# Altium project precursor_pvt2.PrjPcb (part 2 of 3)

## Sheet 03_power.SchDoc
size A3
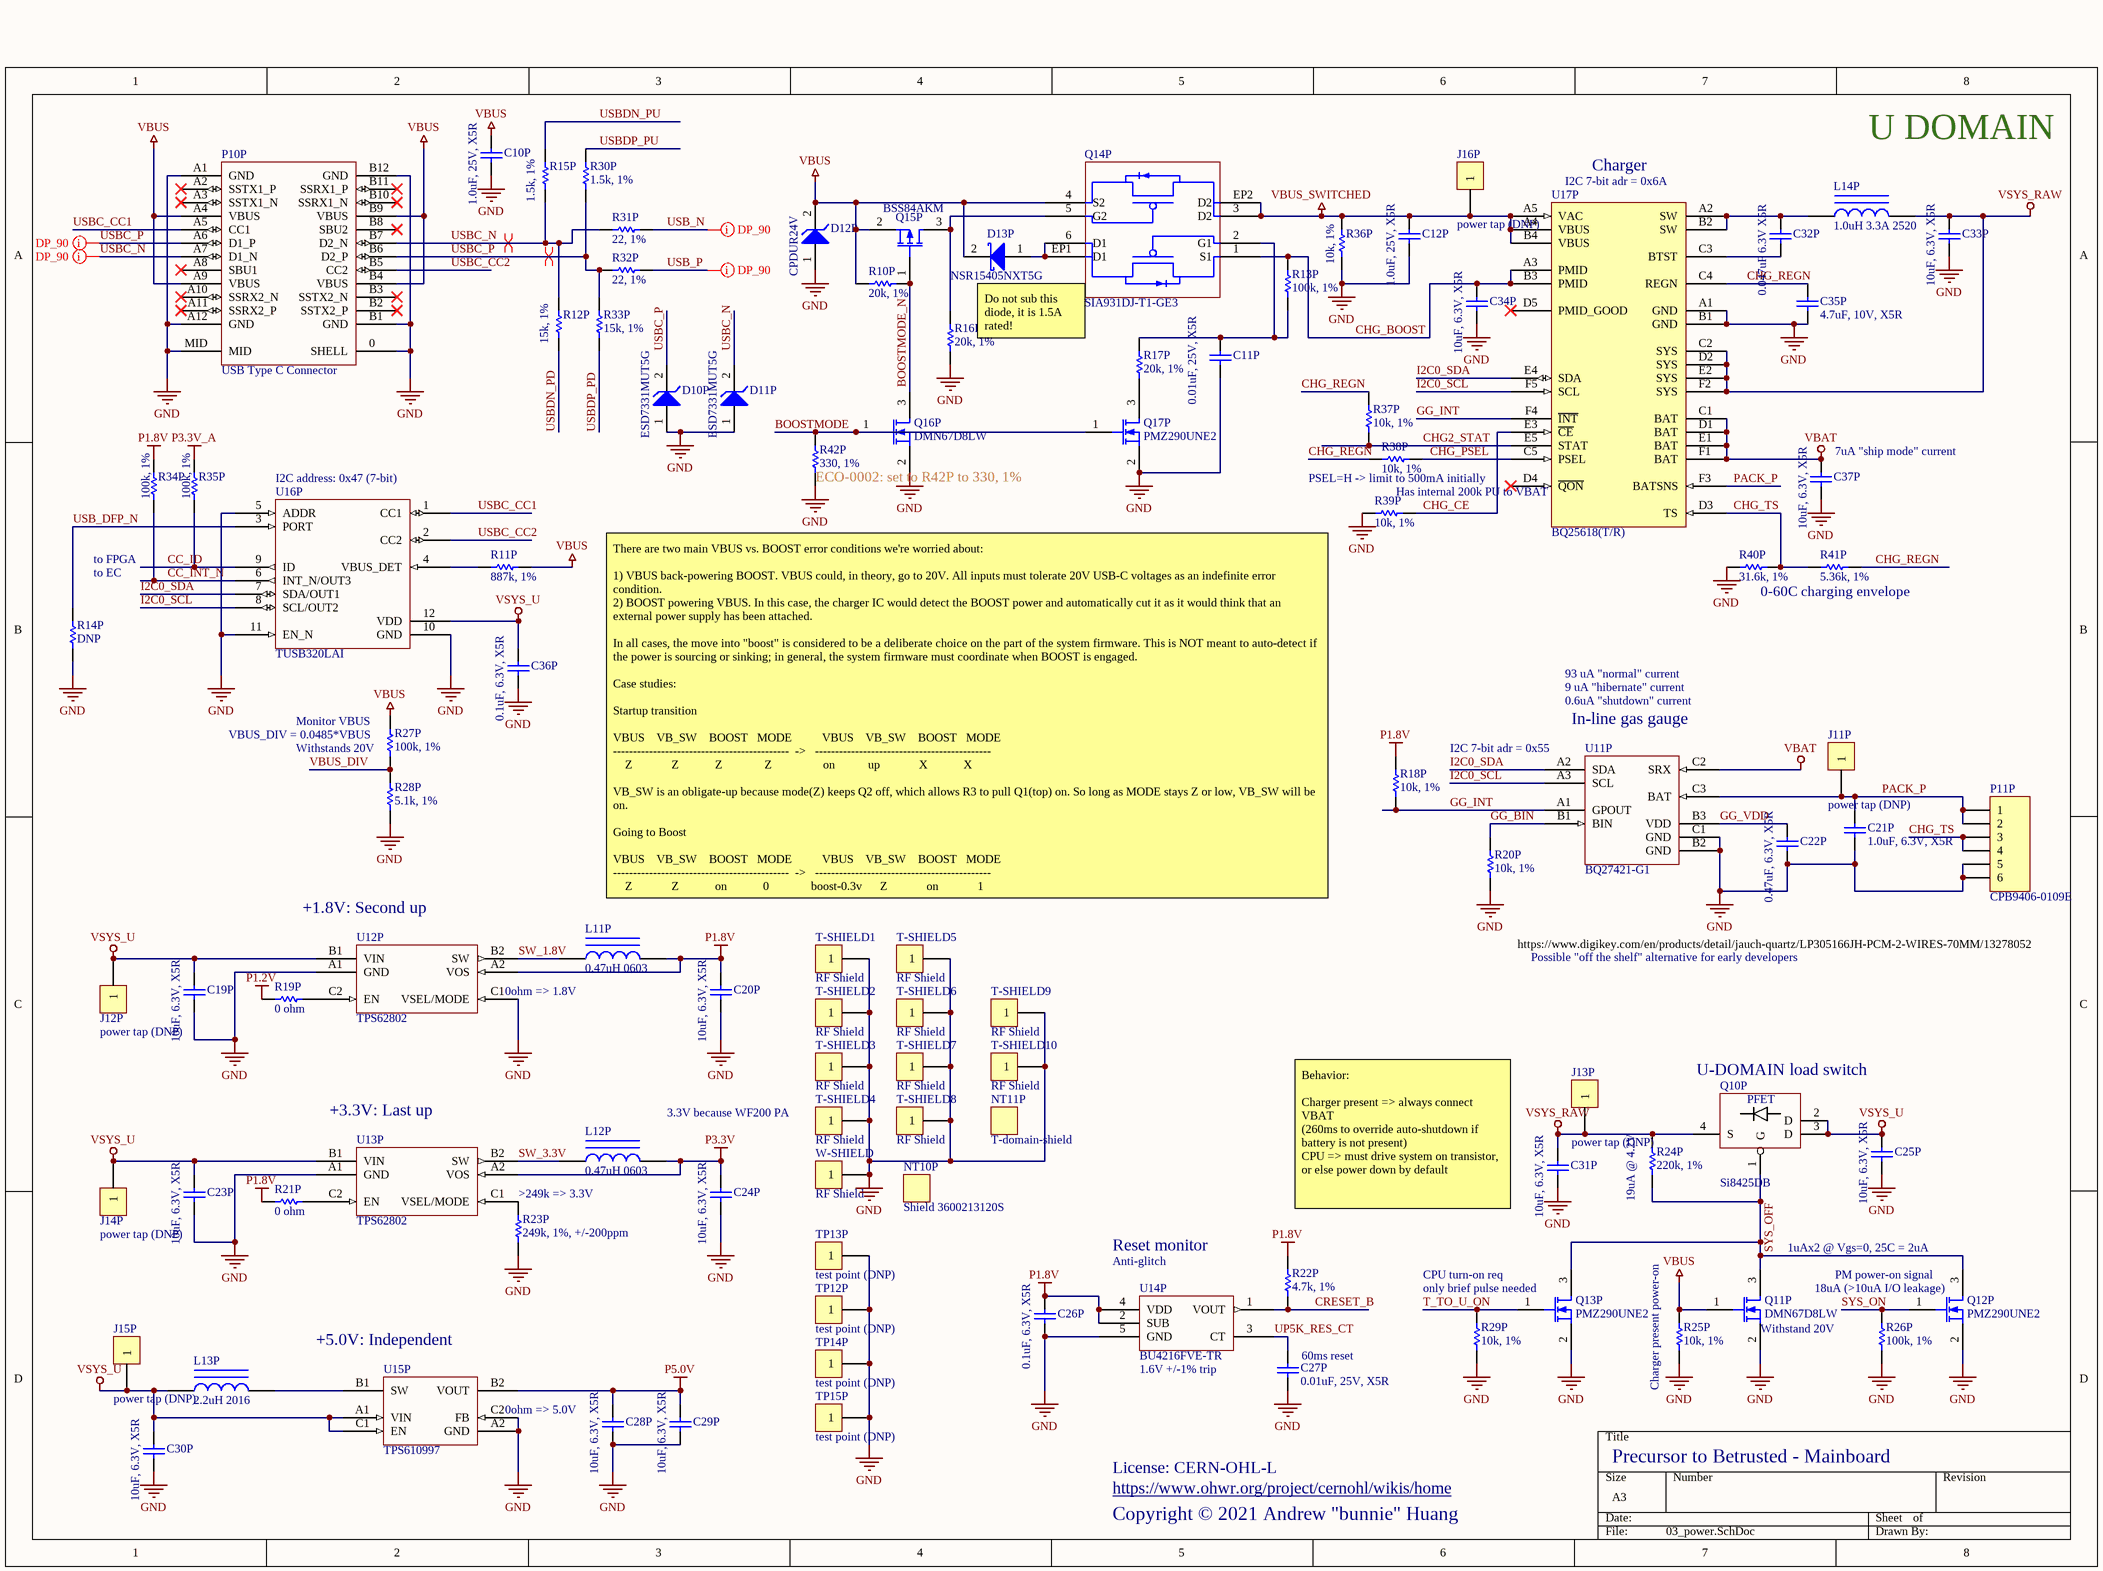
[diagram p4: 03_power.SchDoc]

### Parts
C10P  1.0uF, 25V, X5R  [B_CAP0603]
C11P  0.01uF, 25V, X5R  [B_RES0201]
C12P  1.0uF, 25V, X5R  [B_CAP0603]
C19P  10uF, 6.3V, X5R  [B_CAP0603]
C20P  10uF, 6.3V, X5R  [B_CAP0603]
C21P  1.0uF, 6.3V, X5R  [B_CAP0201]
C22P  0.47uF, 6.3V, X5R  [B_CAP0201]
C23P  10uF, 6.3V, X5R  [B_CAP0603]
C24P  10uF, 6.3V, X5R  [B_CAP0603]
C25P  10uF, 6.3V, X5R  [B_CAP0603]
C26P  0.1uF, 6.3V, X5R  [B_CAP0201]
C27P  0.01uF, 25V, X5R  [B_RES0201]
C28P  10uF, 6.3V, X5R  [B_CAP0603]
C29P  10uF, 6.3V, X5R  [B_CAP0603]
C30P  10uF, 6.3V, X5R  [B_CAP0603]
C31P  10uF, 6.3V, X5R  [B_CAP0603]
C32P  0.047uF 6.3V X5R  [B_CAP0201]
C33P  10uF, 6.3V, X5R  [B_CAP0603]
C34P  10uF, 6.3V, X5R  [B_CAP0603]
C35P  4.7uF, 10V, X5R  [B_CAP0603]
C36P  0.1uF, 6.3V, X5R  [B_CAP0201]
C37P  10uF, 6.3V, X5R  [B_CAP0603]
D10P  ESD7331MUT5G  [D_X3DFN2_0201]
D11P  ESD7331MUT5G  [D_X3DFN2_0201]
D12P  CPDUR24V  [SOD523]
D13P  NSR15405NXT5G  [B_DIO0502]
J11P  power tap (DNP)  [B_PWRTAP0402]
J12P  power tap (DNP)  [RESTAP-0603]
J13P  power tap (DNP)  [RESTAP-0603]
J14P  power tap (DNP)  [RESTAP-0603]
J15P  power tap (DNP)  [B_PWRTAP0402]
J16P  power tap (DNP)  [RESTAP-0603]
L11P  0.47uH 0603  [B_IND0603]
L12P  0.47uH 0603  [B_IND0603]
L13P  2.2uH 2016  [B_IND2016_TDK]
L14P  1.0uH 3.3A 2520  [B_IND2025_SAM]
NT10P  Shield 3600213120S
NT11P  T-domain-shield
P10P  USB Type C Connector  [TE_1-2295018-2]
P11P  CPB9406-0109E  [SMK_CPB9406-0109E]
Q10P  Si8425DB  [VISHAY_MICRO_FOOT_4_BUMP]
Q11P  DMN67D8LW  [SOT323-3AN]
Q12P  PMZ290UNE2  [SOT883]
Q13P  PMZ290UNE2  [SOT883]
Q14P  SIA931DJ-T1-GE3  [VISHAY_POWERPAK_SC70-6L]
Q15P  BSS84AKM  [SOT883]
Q16P  DMN67D8LW  [SOT323-3AN]
Q17P  PMZ290UNE2  [SOT883]
R10P  20k, 1%  [B_RES0201]
R11P  887k, 1%  [B_RES0201]
R12P  15k, 1%  [B_RES0201]
R13P  100k, 1%  [B_RES0201]
R14P  DNP  [B_RES0201]
R15P  1.5k, 1%  [B_RES0201]
R16P  20k, 1%  [B_RES0201]
R17P  20k, 1%  [B_RES0201]
R18P  10k, 1%  [B_RES0201]
R19P  0 ohm  [B_RES0201]
R20P  10k, 1%  [B_RES0201]
R21P  0 ohm  [B_RES0201]
R22P  4.7k, 1%  [B_RES0201]
R23P  249k, 1%, +/-200ppm  [B_RES0402]
R24P  220k, 1%  [B_RES0201]
R25P  10k, 1%  [B_RES0201]
R26P  100k, 1%  [B_RES0201]
R27P  100k, 1%  [B_RES0201]
R28P  5.1k, 1%  [B_RES0201]
R29P  10k, 1%  [B_RES0201]
R30P  1.5k, 1%  [B_RES0201]
R31P  22, 1%  [B_RES0201]
R32P  22, 1%  [B_RES0201]
R33P  15k, 1%  [B_RES0201]
R34P  100k, 1%  [B_RES0201]
R35P  100k, 1%  [B_RES0201]
R36P  10k, 1%  [B_RES0201]
R37P  10k, 1%  [B_RES0201]
R38P  10k, 1%  [B_RES0201]
R39P  10k, 1%  [B_RES0201]
R40P  31.6k, 1%  [B_RES0201]
R41P  5.36k, 1%  [B_RES0201]
R42P  330, 1%  [B_RES0201]
T-SHIELD1  RF Shield  [WURTH_36900000]
T-SHIELD2  RF Shield  [WURTH_36900000]
T-SHIELD3  RF Shield  [WURTH_36900000]
T-SHIELD4  RF Shield  [WURTH_36900000]
T-SHIELD5  RF Shield  [WURTH_36900000]
T-SHIELD6  RF Shield  [WURTH_36900000]
T-SHIELD7  RF Shield  [WURTH_36900000]
T-SHIELD8  RF Shield  [WURTH_36900000]
T-SHIELD9  RF Shield  [WURTH_36900000]
T-SHIELD10  RF Shield  [WURTH_36900000]
TP12P  test point (DNP)  [TP_2MM_SQ]
TP13P  test point (DNP)  [TP_2MM_SQ]
TP14P  test point (DNP)  [TP_2MM_SQ]
TP15P  test point (DNP)  [TP_2MM_SQ]
U11P  BQ27421-G1  [BGA9C50P3X3_162X158X62]
U12P  TPS62802  [BGA6C35P2X3_70X105X40_NSMD]
U13P  TPS62802  [BGA6C35P2X3_70X105X40_NSMD]
U14P  BU4216FVE-TR  [ROHM_VSOF5]
U15P  TPS610997  [BGA6C40P2X3_88X123X62]
U16P  TUSB320LAI  [QFN40P160X160X40-12N]
U17P  BQ25618(T/R)  [BGA30C40P5X6_196X236X62]
W-SHIELD  RF Shield  [WURTH_36X021312XS]

### Nets
GND: C10P.2 C11P.2 C12P.2 C19P.2 C20P.2 C21P.1 C22P.2 C23P.2 C24P.2 C25P.2 C26P.2 C27P.2 C28P.2 C29P.2 C30P.2 C31P.2 C33P.2 C34P.2 C35P.1 C36P.2 C37P.2 D10P.1(A) D11P.1(A) D12P.1(A) P10P.0(SHELL) P10P.A1(GND) P10P.A12(GND) P10P.B1(GND) P10P.B12(GND) P10P.MID P11P.5 P11P.6 Q11P.2(S) Q12P.2(S) Q13P.2(S) Q16P.2(S) Q17P.2(S) R14P.2 R16P.1 R20P.2 R23P.2 R25P.2 R26P.1 R28P.2 R29P.2 R36P.1 R39P.1 R40P.1 R42P.1 T-SHIELD1.1 T-SHIELD2.1 T-SHIELD3.1 T-SHIELD4.1 T-SHIELD5.1 T-SHIELD6.1 T-SHIELD7.1 T-SHIELD8.1 T-SHIELD9.1 T-SHIELD10.1 TP12P.1 TP13P.1 TP14P.1 TP15P.1 U11P.B2(GND) U11P.C1(GND) U12P.A1(GND) U12P.C1(VSEL/MODE) U13P.A1(GND) U14P.5(GND) U15P.A2(GND) U15P.C2(FB) U16P.5(ADDR) U16P.10(GND) U16P.11(EN_N) U17P.A1(GND) U17P.B1(GND) W-SHIELD.1
P1.2V: R19P.1
P1.8V: C20P.1 C26P.1 L11P.2 R18P.1 R21P.1 R22P.2 R34P.2 U12P.A2(VOS) U14P.2(SUB) U14P.4(VDD)
P3.3V: C24P.1 L12P.2 U13P.A2(VOS)
P3.3V_A: R35P.2
P5.0V: C28P.1 C29P.1 U15P.B2(VOUT)
PACK_P: C21P.2 J11P.1 P11P.1 P11P.2 U11P.C3(BAT) U17P.F3(BATSNS)
VBAT: C37P.1 U11P.C2(SRX) U17P.C1(BAT) U17P.D1(BAT) U17P.E1(BAT) U17P.F1(BAT)
VBUS: C10P.1 D12P.2(K) D13P.2(K) P10P.A4(VBUS) P10P.A9(VBUS) P10P.B4(VBUS) P10P.B9(VBUS) Q11P.1(G) Q14P.4(S2) Q15P.2(S) R10P.2 R11P.1 R25P.1 R27P.2
VBUS_SWITCHED: C12P.1 J16P.1 Q14P.3(D2) Q14P.EP2(D2) R36P.2 U17P.A4(VBUS) U17P.A5(VAC) U17P.B4(VBUS)
VSYS_RAW: C31P.1 C33P.1 J13P.1 L14P.2 Q10P.4(S) R24P.2 U17P.C2(SYS) U17P.D2(SYS) U17P.E2(SYS) U17P.F2(SYS)
VSYS_U: C19P.1 C23P.1 C25P.1 C30P.1 C36P.1 J12P.1 J14P.1 J15P.1 L13P.1 Q10P.2(D) Q10P.3(D) U12P.B1(VIN) U13P.B1(VIN) U15P.A1(VIN) U15P.C1(EN) U16P.12(VDD)
BOOSTMODE: Q16P.1(G) Q17P.1(G) R42P.2
BOOSTMODE_N: Q15P.1(G) Q16P.3(D) R10P.1
CC_ID: R35P.1 U16P.9(ID)
CC_INT_N: R34P.1 U16P.6(INT_N/OUT3)
CHG2_STAT: R37P.2 U17P.E5(STAT)
CHG_BOOST: C34P.1 Q14P.1(S1) R13P.1 U17P.A3(PMID) U17P.B3(PMID)
CHG_CE: R39P.2 U17P.E3(~{CE})
CHG_PSEL: R38P.2 U17P.C5(PSEL)
CHG_REGN: C35P.2 R37P.1 R38P.1 R41P.2 U17P.C4(REGN)
CHG_TS: P11P.3 P11P.4 R40P.2 R41P.1 U17P.D3(TS)
CRESET_B: R22P.1 U14P.1(VOUT)
GG_BIN: R20P.1 U11P.B1(BIN)
GG_INT: R18P.2 U11P.A1(GPOUT) U17P.F4(~{INT})
GG_VDD: C22P.1 U11P.B3(VDD)
I2C0_SCL: U11P.A3(SCL) U16P.8(SCL/OUT2) U17P.F5(SCL)
I2C0_SDA: U11P.A2(SDA) U16P.7(SDA/OUT1) U17P.E4(SDA)
SW_1.8V: L11P.1 U12P.B2(SW)
SW_3.3V: L12P.1 U13P.B2(SW)
SYS_OFF: Q10P.1(G) Q11P.3(D) Q12P.3(D) Q13P.3(D) R24P.1
SYS_ON: Q12P.1(G) R26P.2
T_TO_U_ON: Q13P.1(G) R29P.1
UP5K_RES_CT: C27P.1 U14P.3(CT)
USB_DFP_N: R14P.1 U16P.3(PORT)
USB_N: R31P.2
USB_P: R32P.2
USBC_CC1: P10P.A5(CC1) U16P.1(CC1)
USBC_CC2: P10P.B5(CC2) U16P.2(CC2)
USBC_N: D11P.2(K) P10P.A7(D1_N) P10P.B7(D2_N) R12P.1 R15P.1 R31P.1
USBC_P: D10P.2(K) P10P.A6(D1_P) P10P.B6(D2_P) R30P.1 R32P.1 R33P.1
USBDN_PD: R12P.2
USBDN_PU: R15P.2
USBDP_PD: R33P.2
USBDP_PU: R30P.2
VBUS_DIV: R27P.1 R28P.1
NetC11P_1: C11P.1 Q14P.2(G1) R13P.2 R17P.2
NetC32P_1: C32P.1 L14P.1 U17P.A2(SW) U17P.B2(SW)
NetC32P_2: C32P.2 U17P.C3(BTST)
NetD13P_1: D13P.1(A) Q14P.6(D1) Q14P.EP1(D1)
NetL13P_2: L13P.2 U15P.B1(SW)
NetQ14P_5: Q14P.5(G2) Q15P.3(D) R16P.2
NetQ17P_3: Q17P.3(D) R17P.1
NetR11P_2: R11P.2 U16P.4(VBUS_DET)
NetR19P_2: R19P.2 U12P.C2(EN)
NetR21P_2: R21P.2 U13P.C2(EN)
NetR23P_1: R23P.1 U13P.C1(VSEL/MODE)

Not connected (* = marked no-connect by the designer): P10P A2(SSTX1_P)* A3(SSTX1_N)* A8(SBU1)* A10(SSRX2_N)* A11(SSRX2_P)* B2(SSTX2_P)* B3(SSTX2_N)* B8(SBU2)* B10(SSRX1_N)* B11(SSRX1_P)*; U17P D4(~{QON})* D5(PMID_GOOD)*

### Layout directives
differential pair: USBC_N, USBC_P
net class DP_90: USB_N, USB_P, USBC_N, USBC_P

### Notes on the sheet
- (near U17P) Charger
- U DOMAIN
- (near U17P) I2C 7-bit adr = 0x6A
- Do not sub this diode, it is 1.5A rated!
- (near U16P) I2C address: 0x47 (7-bit)
- (near R42P) ECO-0002: set to R42P to 330, 1%
- (near R38P) PSEL=H -> limit to 500mA initially
- (near U17P) Has internal 200k PU to VBAT
- (near C37P) 7uA "ship mode" current
- (near R14P) to EC
- to FPGA
- 0-60C charging envelope
- 93 uA "normal" current
- 0.6uA "shutdown" current
- 9 uA "hibernate" current
- (near R27P) VBUS_DIV = 0.0485*VBUS
- (near R27P) Monitor VBUS
- (near R27P) Withstands 20V
- (near U11P) I2C 7-bit adr = 0x55
- (near U11P) In-line gas gauge
- (near U12P) +1.8V: Second up
- There are two main VBUS vs. BOOST error conditions we're worried about:
  1) VBUS back-powering BOOST. VBUS could, in theory, go to 20V. All inputs must tolerate 20V USB-C voltages as an indefinite error condition.
  2) BOOST powering VBUS. In this case, the charger IC would detect the BOOST power and automatically cut it as it would think that an external power supply has been attached.
  In all cases, the move into "boost" is considered to be a deliberate choice on the part of the system firmware. This is NOT meant to auto-detect if the power is sourcing or sinking; in general, the system firmware must coordinate when BOOST is engaged.
  Case studies:
  Startup transition
  VBUS    VB_SW    BOOST   MODE          VBUS    VB_SW    BOOST   MODE
  --------------------------------------------  ->   --------------------------------------------
  Z             Z            Z              Z                 on           up             X            X
  VB_SW is an obligate-up because mode(Z) keeps Q2 off, which allows R3 to pull Q1(top) on. So long as MODE stays Z or low, VB_SW will be on.
  Going to Boost
  VBUS    VB_SW    BOOST   MODE          VBUS    VB_SW    BOOST   MODE
  --------------------------------------------  ->   --------------------------------------------
  Z             Z            on            0              boost-0.3v      Z             on             1
  Initially, boost is ON, VBUS is disconnected (Z), mode is off. VB_SW is obligate Z because it's connected to VBUS, and BOOST is isolated from VBUS because Q1(bot) is off due to R2 bringing VGS=0 and Q4 being off, and the body diode is reverse biased. Mode going from 0->1 will bring Q2 VGS > -1.6V and thus"on" (around 6 ohm), making Q1(top) VGS  0 and thus off. VB_SW is isolated. Also mode going 0->1 brings Q4 on, which takes Q1(bot) VGS > -1.8V, turning it on, and thus causing BOOST to conduct to VBUS less D2 drop of 0.3V. BOOST regulation is 5.15V, so VBUS is around 4.85V, within spec for VBUS source.
  It is important that VB_SW does not get the BOOST voltage, as this will cause BOOST to turn off. It may be more desirable then to do this scenario:
  Going to Boost
  VBUS    VB_SW    BOOST   MODE          VBUS    VB_SW    BOOST   MODE
  --------------------------------------------  ->   --------------------------------------------
  Z             Z            Z            1              boost-0.3v      Z             on             1
  In this case, everything is hi-Z to start with, MODE is switched on; this forces Q2 on, and thus Q1(top) off. Q4 on turns Q1(bot) on. As BOOST rises, Q1(bot) definitively turns on, charging VBUS. As VBUS rises, Q1(top) should never conduct as Q2 keeps VGS0, thus VB_SW should never see the BOOST voltage (this is good). There may be some charge bootstrapping but CQ1 is << CVB_SW.
  Leaving boost
  This can be accomplished either by dropping BOOST or MODE first, then applying VBUS.
  Error condition 1: VBUS is applied (at possibly 20V), BOOST active
  In this case, D2 protects CHG_BOOST, when both in MODE is 1 or 0. D2 is necessary because of the body diode in Q1. D2 could be replaced with a transistor for better efficiency, but space limitations and cost drives the choice of using a diode not a transistor.
  D2 is rated to 30V, Q1 VDSS to 30V, Q2 VDSS is 50V. Q1, Q2 VGS is -20V, which is slightly dicey but probably OK.
  Q3 rated to 60V VDSS, -30V VGS, which is ideal. Q4 is not rated for 20V operation, but the BOOST node is incapable of going over 5.15V, and is protected by D2.
  VB_SW can handle 20V (regulator can tolerate this).
  Error condition 2: Boost powering VBUS
  The main mechanism for this to happen is if Q4/Q1(bot) combo makes a closed circuit before Q3/Q2/Q1(top) can become an open circuit, and BOOST is powered on while this is happening.
  This seems possible -- Q4->Q1 chain has a lower VGS device, and fewer devices in the signal path. Thus it may be preferable to add a small capacitance off of the Q4 drain to keep it from falling faster than Q1 gate can rise. Alternatively, software can simply enforce that MODE is active before BOOST is programmed, thus completely disallowing the error condition.
- https://www.digikey.com/en/products/detail/jauch-quartz/LP305166JH-PCM-2-WIRES-70MM/13278052
- Possible "off the shelf" alternative for early developers
- 0ohm => 1.8V
- (near U13P) +3.3V: Last up
- 3.3V because WF200 PA
- (near Q10P) U-DOMAIN load switch
- (near R23P) >249k => 3.3V
- Reset monitor
- Behavior:
  Charger present => always connect VBAT
  (260ms to override auto-shutdown if battery is not present)
  CPU => must drive system on transistor, or else power down by default
- (near R24P) 19uA @ 4.2V
- 1uAx2 @ Vgs=0, 25C = 2uA
- (near U14P) Anti-glitch
- CPU turn-on req
- (near Q13P) only brief pulse needed
- (near Q12P) 18uA (>10uA I/O leakage)
- (near Q12P) PM power-on signal
- (near U15P) +5.0V: Independent
- (near U14P) 1.6V +/-1% trip
- (near C27P) 60ms reset
- (near R25P) Charger present power-on
- (near Q11P) Withstand 20V
- 0ohm => 5.0V
- License: CERN-OHL-L
- Copyright © 2021 Andrew "bunnie" Huang
- https://www.ohwr.org/project/cernohl/wikis/home
- Precursor to Betrusted - Mainboard
- (in symbol Si8425DB) PFET

### Library data of the parts
C10P C12P = Cap Semi: as C63F on sheet 01_fpga
C11P C27P = Cap Semi: as C35F on sheet 01_fpga
C19P C20P C23P C24P C25P C28P C29P C30P C31P C33P C34P C37P = Cap Semi: as C11F on sheet 01_fpga
C21P = Cap Semi: as C22F on sheet 01_fpga
C22P = Cap Semi: as C10F on sheet 01_fpga
C26P C36P = Cap Semi: as C12F on sheet 01_fpga
C32P = Cap Semi: Capacitor (Semiconductor SIM Model); MPN: GRM033C81A473KE05D; VENDOR: Murata; MYPN: C-473-10-X6S-0201
C35P = Cap Semi: Capacitor (Semiconductor SIM Model); MPN: CL10A475KP8NNNC; VENDOR: Samsung; MYPN: C-475-10-X5R-0603
D10P D11P = D Zener: VENDOR: ON Semi; MYPN: D-ESD7331MUT5G; Published: 8-Jun-2000; LatestRevisionDate: 17-Jul-2002; LatestRevisionNote: Re-released for DXP Platform.; PackageReference: DIODE-0.7; Publisher: Altium Limited; PackageDescription: Diode, Thru-Hole; 2 Leads; 0.7 in Pin Spacing; MPN: ESD7331MUT5G
D12P = D Zener: VENDOR: Comchip Technology; MYPN: D-CPDUR24V; Published: 8-Jun-2000; LatestRevisionDate: 17-Jul-2002; LatestRevisionNote: Re-released for DXP Platform.; PackageReference: DIODE-0.7; Publisher: Altium Limited; PackageDescription: Diode, Thru-Hole; 2 Leads; 0.7 in Pin Spacing; MPN: CPDUR24V
D13P = Diode 11DQ03: Schottky Rectifier; MYPN: D-SCHOTTKY-0402-CSP; VENDOR: On Semiconductor; ComponentLink1Description: Manufacturer Link; ComponentLink1URL: http://www.irf.com/; ComponentLink2Description: Datasheet; ComponentLink2URL: http://www.irf.com/product-info/datasheets/data/11dq03.pdf; MPN: NSR15405NXT5G
J11P J12P J13P J14P J15P J16P = CON1: Connector; MYPN: J-TP-PWRTAP-0603; MPN: DNP; VENDOR: DNP
L11P L12P = Inductor Iron: as L12F on sheet 01_fpga
L13P = Inductor Iron: Magnetic-Core Inductor; MPN: VLS201610CX-2R2M-1; VENDOR: TDK; MYPN: L-VLS201610CX-2R2M-1
L14P = Inductor Iron: Magnetic-Core Inductor; MPN: CIGW252010GL1R0MNE; VENDOR: Samsung; MYPN: L-CIGW252010GL1R0MNE
NT10P = NOTE: RF Shield snap-on; MYPN: NT-3600213120S; VENDOR: Wurth; MPN: 3600213120S
NT11P = NOTE: RF Shield snap-on C7521; MPN: t-domain-shield-c7521; VENDOR: AQS; MYPN: t-domain-shield-c7521
P10P = USB_TYPE_C: MPN: 1-2295018-2; VENDOR: TE Connectivity AMP Connectors; MYPN: P-1-2295018-2
P11P = Header 6: Header, 6-Pin; VENDOR: SMK; LatestRevisionDate: 17-Jul-2002; LatestRevisionNote: Re-released for DXP Platform.; Publisher: Altium Limited; MPN: CPB9406-0109E; MYPN: CPB9406-0109E
Q10P = Si8425DB: P-channel 20V 6.2A 27mOhm @ -2.5V; MPN: SI8425DB-T1-E1; VENDOR: Vishay Siliconix; MYPN: Q-Si8425
Q11P Q16P = MOSFET-N: N-Channel MOSFET; VENDOR: Diodes Inc; MYPN: Q-DMN67D8LW; Published: 8-Jun-2000; LatestRevisionDate: 17-Jul-2002; LatestRevisionNote: Re-released for DXP Platform.; PackageVersion: 1995/1996; PackageReference: E3; Publisher: Altium Limited; MPN: DMN67D8LW
Q12P Q13P Q17P = MOSFET-N: N-Channel MOSFET; MPN: PMZ290UNE2YL; VENDOR: Nexperia; MYPN: Q-PMZ290UNE2; Published: 8-Jun-2000; LatestRevisionDate: 17-Jul-2002; LatestRevisionNote: Re-released for DXP Platform.; PackageVersion: 1995/1996; PackageReference: E3; Publisher: Altium Limited
Q14P = SIA931DJ: Dual P-channel 30V MOSFET; MYPN: Q-SIA931DJ-T1-GE3; VENDOR: Vishay Siliconix; MPN: SIA931DJ-T1-GE3
Q15P = MOSFET-P: P-Channel MOSFET; MPN: BSS84AKM,315; VENDOR: NXP; MYPN: Q-BSS84AKM; Published: 8-Jun-2000; LatestRevisionDate: 17-Jul-2002; LatestRevisionNote: Re-released for DXP Platform.; PackageVersion: 1995/1996; PackageReference: E3; Publisher: Altium Limited; PackageDescription: TO, Flat Index; 3 In-Line, Axial Leads; Body Dia. 4.6mm; Lead Dia. 0.5 mm (max)
R10P R16P R17P = Res1: Resistor; VENDOR: ANY; MYPN: R-203-1P-1_16W-0201; MPN: ANY
R11P = Res1: Resistor; VENDOR: ANY; MYPN: R-8873-1P-1_16W-0201; MPN: ANY
R12P R33P = Res1: Resistor; VENDOR: ANY; MYPN: R-153-1P-1_16W-0201; MPN: ANY
R13P R26P R27P R34P R35P = Res1: as R14F on sheet 01_fpga; MPN: ANY
R14P = Res1: Resistor; VENDOR: ANY; MYPN: DNP; MPN: ANY
R15P R30P = Res1: Resistor; VENDOR: ANY; MYPN: R-152-1P-1_16W-0201; MPN: ANY
R18P R20P R25P R29P R36P R37P R38P R39P = Res1: as R16F on sheet 01_fpga; MPN: ANY
R19P R21P = Res1: as R12F on sheet 01_fpga; MPN: ANY
R22P = Res1: as R15F on sheet 01_fpga; MPN: ANY
R23P = Res1: Resistor; MPN: RC0402FR-07249KL; VENDOR: Yageo; MYPN: R-2493-1P-1_16W-0402
R24P = Res1: as R10F on sheet 01_fpga; MPN: ANY
R28P = Res1: Resistor; VENDOR: ANY; MYPN: R-512-1P-1_16W-0201; MPN: ANY
R31P R32P = Res1: Resistor; VENDOR: ANY; MYPN: R-220-1P-1_16W-0201; MPN: ANY
R40P = Res1: Resistor; VENDOR: ANY; MYPN: R-3162-1P-1_16W-0201; MPN: ANY
R41P = Res1: Resistor; VENDOR: ANY; MYPN: R-5361-1P-1_16W-0201; MPN: ANY
R42P = Res1: Resistor; VENDOR: ANY; MYPN: R-331-1P-1_16W-0201; MPN: ANY
T-SHIELD1-T-SHIELD10 = CON1: Connector; MPN: FDX0070A1; MYPN: J-36900000; VENDOR: 深圳市元升电子有限公司
TP12P TP13P TP14P TP15P = CON1: Connector; MYPN: Built into PCB; MPN: DNP; VENDOR: DNP
U11P = BQ27421-G1: System-Side Impedance Track Fuel Gauge with integrated Sense Resistor; MPN: bq27421YZFT-G1A; VENDOR: TI; MYPN: bq27421YZF(T/R)-G1A
U12P U13P = TPS62802: as U13F on sheet 01_fpga
U14P = BU42xxFVE: Low voltage free delay time setting CMOS voltage detector IC; MYPN: U-BU4216FVE-TR; VENDOR: Rohm; MPN: BU4216FVE-TR
U15P = TPS610997: Synchronous Boost Converter with Ultra-Low Iq; MPN: TPS610997YFFR; VENDOR: TI; MYPN: TPS610997YFFT(T/R)
U16P = TUSB320LAI: USB Type-C Configuration Channel Logic and Port Control; MPN: TUSB320LAIRWBR; VENDOR: TI; MYPN: U-TUSB320LAI
U17P = BQ25618: I2C controlled 1-cell 1.5A battery charger with 20mA termination and 1A boost operation; MPN: BQ25618YFFT; VENDOR: TI; MYPN: U-BQ25618YFF(T/R)
W-SHIELD = CON1: Connector; MPN: 3610213126S; VENDOR: Wurth; MYPN: 3610213126S

## Sheet 04_io.SchDoc
size B
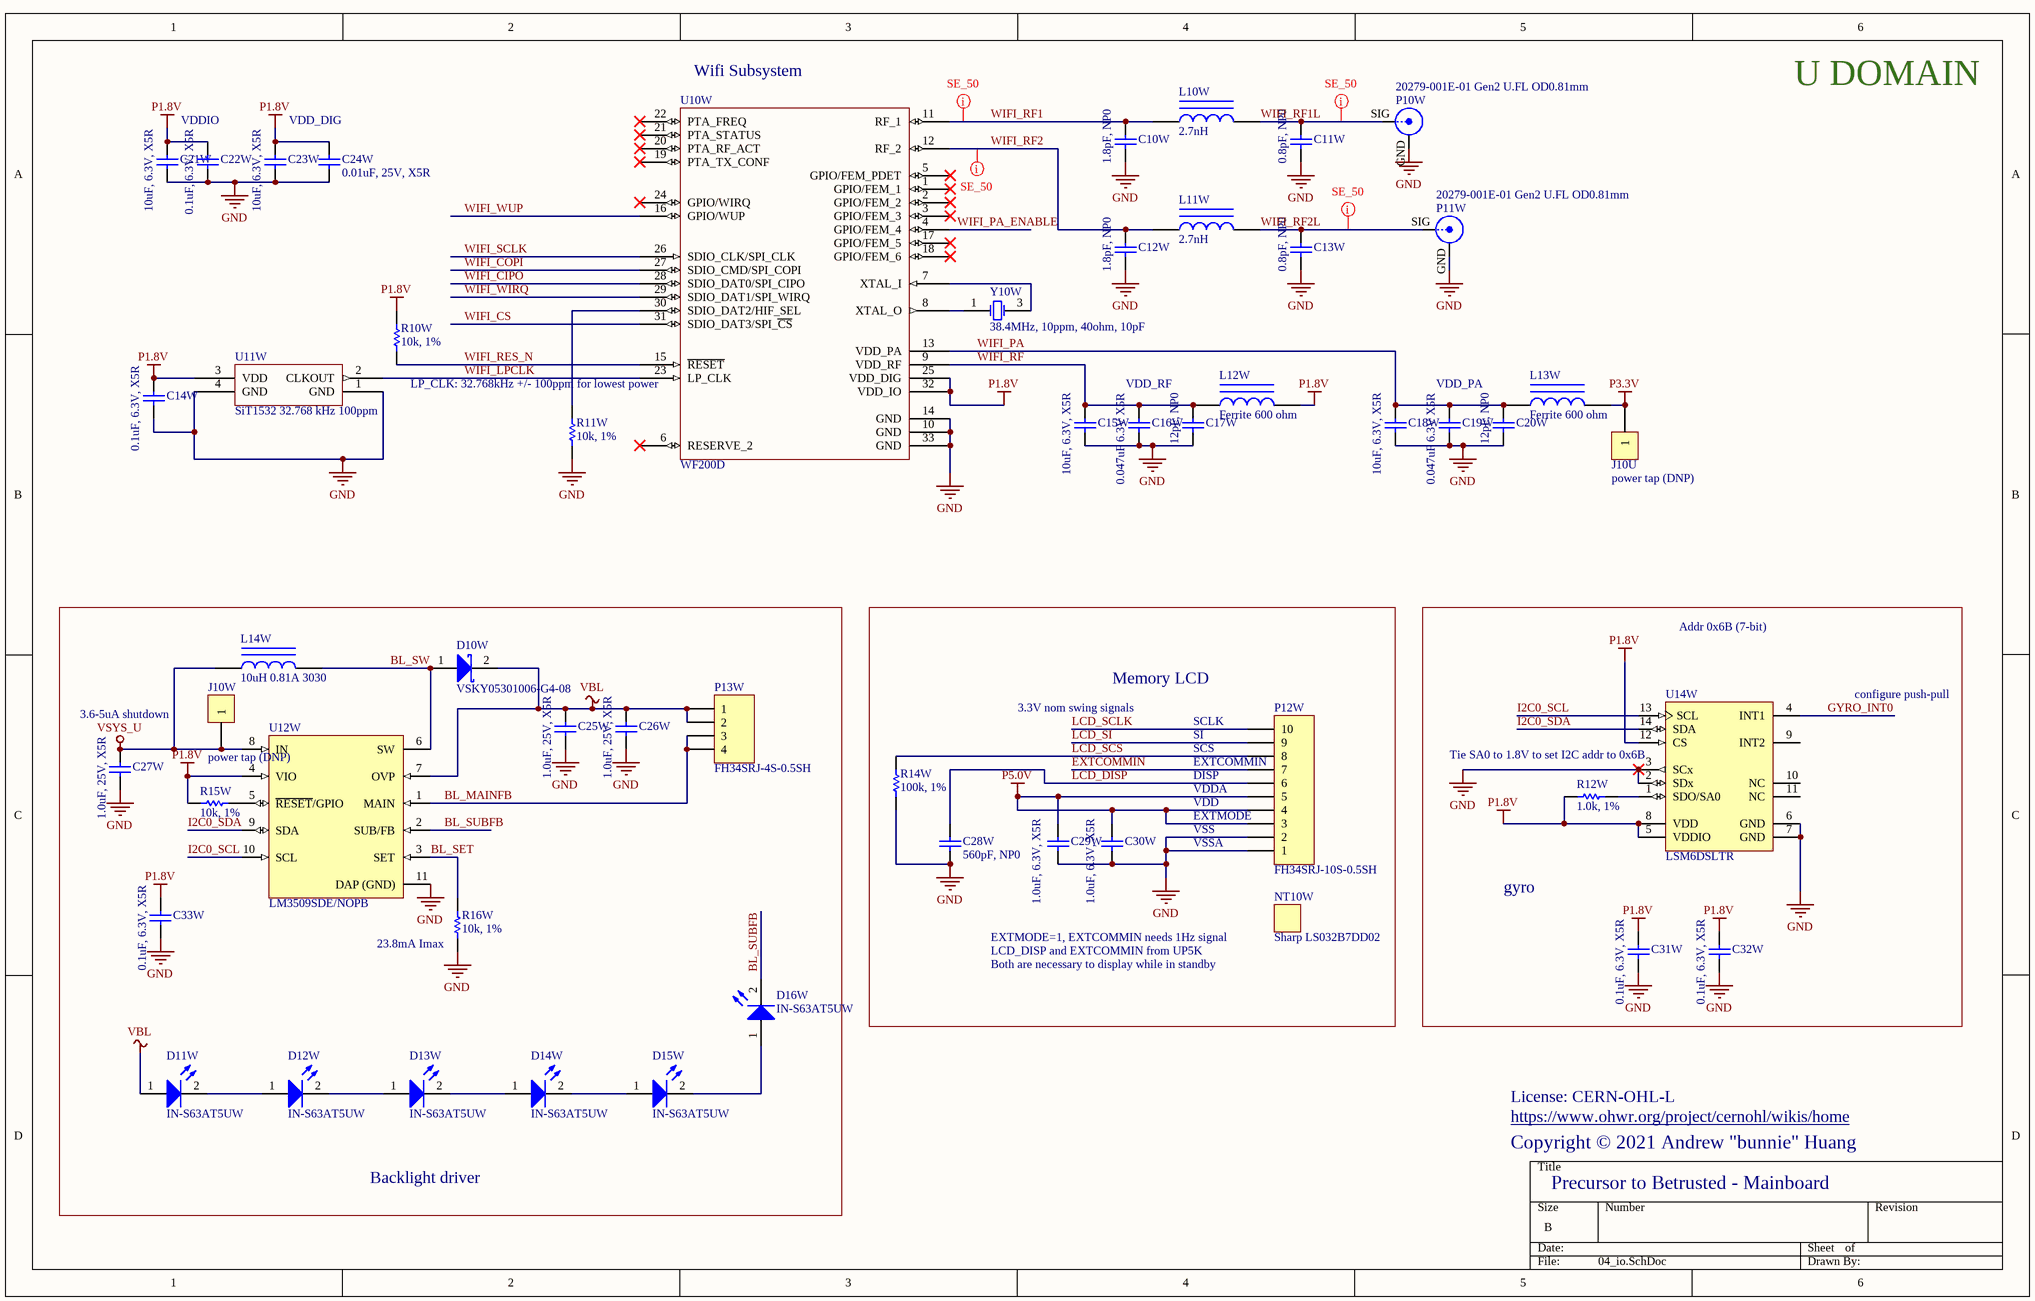
[diagram p5: 04_io.SchDoc]

### Parts
C10W  1.8pF, NP0  [B_CAP0201]
C11W  0.8pF, NP0  [B_CAP0201]
C12W  1.8pF, NP0  [B_CAP0201]
C13W  0.8pF, NP0  [B_CAP0201]
C14W  0.1uF, 6.3V, X5R  [B_CAP0201]
C15W  10uF, 6.3V, X5R  [B_CAP0603]
C16W  0.047uF 6.3V X5R  [B_CAP0201]
C17W  12pF, NP0  [B_CAP0201]
C18W  10uF, 6.3V, X5R  [B_CAP0603]
C19W  0.047uF 6.3V X5R  [B_CAP0201]
C20W  12pF, NP0  [B_CAP0201]
C21W  10uF, 6.3V, X5R  [B_CAP0603]
C22W  0.1uF, 6.3V, X5R  [B_CAP0201]
C23W  10uF, 6.3V, X5R  [B_CAP0603]
C24W  0.01uF, 25V, X5R  [B_RES0201]
C25W  1.0uF, 25V, X5R  [B_CAP0603]
C26W  1.0uF, 25V, X5R  [B_CAP0603]
C27W  1.0uF, 25V, X5R  [B_CAP0603]
C28W  560pF, NP0  [B_RES0201]
C29W  1.0uF, 6.3V, X5R  [B_CAP0201]
C30W  1.0uF, 6.3V, X5R  [B_CAP0201]
C31W  0.1uF, 6.3V, X5R  [B_CAP0201]
C32W  0.1uF, 6.3V, X5R  [B_CAP0201]
C33W  0.1uF, 6.3V, X5R  [B_CAP0201]
D10W  VSKY05301006-G4-08  [B_DIO0402]
D11W  IN-S63AT5UW  [B_DIO0603]
D12W  IN-S63AT5UW  [B_DIO0603]
D13W  IN-S63AT5UW  [B_DIO0603]
D14W  IN-S63AT5UW  [B_DIO0603]
D15W  IN-S63AT5UW  [B_DIO0603]
D16W  IN-S63AT5UW  [B_DIO0603]
J10U  power tap (DNP)  [RESTAP-0603]
J10W  power tap (DNP)  [RESTAP-0603]
L10W  2.7nH  [B_IND0402]
L11W  2.7nH  [B_IND0402]
L12W  Ferrite 600 ohm  [B_IND0603]
L13W  Ferrite 600 ohm  [B_IND0603]
L14W  10uH 0.81A 3030  [B_IND3030_MUR]
NT10W  Sharp LS032B7DD02
P10W  20279-001E-01 Gen2 U.FL OD0.81mm  [HRS_U.FL]
P11W  20279-001E-01 Gen2 U.FL OD0.81mm  [HRS_U.FL]
P12W  FH34SRJ-10S-0.5SH  [HRS_FH34SRJ-10S-0.5SH(50)]
P13W  FH34SRJ-4S-0.5SH  [HRS_FH34SRJ-4S-0.5SH(50)]
R10W  10k, 1%  [B_RES0201]
R11W  10k, 1%  [B_RES0201]
R12W  1.0k, 1%  [B_RES0201]
R14W  100k, 1%  [B_RES0201]
R15W  10k, 1%  [B_RES0201]
R16W  10k, 1%  [B_RES0201]
U10W  WF200D  [QFN40P400X400X90_HS-33N]
U11W  SiT1532 32.768 kHz 100ppm  [SiTIME_CSP]
U12W  LM3509SDE/NOPB  [DSC0010A_V]
U14W  LSM6DSLTR  [LGA-14_2500X3000X860_N]
Y10W  38.4MHz, 10ppm, 40ohm, 10pF  [XOSC_3.2_2.5]

### Blocks framed on the sheet
Backlight driver: C25W C26W C27W C33W D10W D11W D12W D13W D14W D15W D16W J10W L14W P13W R15W R16W U12W
Memory LCD: C28W C29W C30W NT10W P12W R14W
gyro: C31W C32W R12W U14W

### Nets
GND: C10W.2 C11W.2 C12W.2 C13W.2 C14W.2 C15W.2 C16W.2 C17W.2 C18W.2 C19W.2 C20W.2 C21W.2 C22W.2 C23W.2 C24W.2 C25W.2 C26W.2 C27W.2 C28W.2 C29W.1 C30W.1 C31W.2 C32W.2 C33W.2 P10W.GND(Y) P11W.GND(Y) P12W.1 P12W.2 R11W.2 R14W.1 R16W.2 U10W.10(GND) U10W.14(GND) U10W.33(GND) U11W.1(GND) U11W.4(GND) U12W.11(DAP_(GND)) U14W.2(SDx) U14W.3(SCx) U14W.6(GND) U14W.7(GND)
P1.8V: C14W.1 C21W.1 C22W.1 C23W.1 C24W.1 C31W.1 C32W.1 C33W.1 L12W.2 R10W.1 R12W.2 R15W.1 U10W.25(VDD_DIG) U10W.32(VDD_IO) U11W.3(VDD) U12W.4(VIO) U14W.5(VDDIO) U14W.8(VDD) U14W.12(CS)
P3.3V: J10U.1 L13W.2
P5.0V: C29W.2 C30W.2 P12W.3 P12W.4 P12W.5
VBL: C25W.1 C26W.1 D10W.2(K) D11W.1(A) P13W.1 P13W.2 U12W.7(OVP)
VSYS_U: C27W.1 J10W.1 L14W.1 U12W.8(IN)
BL_MAINFB: P13W.3 P13W.4 U12W.1(MAIN)
BL_SET: R16W.1 U12W.3(SET)
BL_SUBFB: D16W.2(K) U12W.2(SUB/FB)
BL_SW: D10W.1(A) L14W.2 U12W.6(SW)
EXTCOMMIN: P12W.7
GYRO_INT0: U14W.4(INT1)
I2C0_SCL: U12W.10(SCL) U14W.13(SCL)
I2C0_SDA: U12W.9(SDA) U14W.14(SDA)
LCD_DISP: C28W.1 P12W.6
LCD_SCLK: P12W.10
LCD_SCS: P12W.8 R14W.2
LCD_SI: P12W.9
WIFI_CIPO: U10W.28(SDIO_DAT0/SPI_CIPO)
WIFI_COPI: U10W.27(SDIO_CMD/SPI_COPI)
WIFI_CS: U10W.31(SDIO_DAT3/SPI_~{CS})
WIFI_LPCLK: U10W.23(LP_CLK) U11W.2(CLKOUT)
WIFI_PA: C18W.1 C19W.1 C20W.1 L13W.1 U10W.13(VDD_PA)
WIFI_PA_ENABLE: U10W.4(GPIO/FEM_4)
WIFI_RES_N: R10W.2 U10W.15(~{RESET})
WIFI_RF: C15W.1 C16W.1 C17W.1 L12W.1 U10W.9(VDD_RF)
WIFI_RF1: C10W.1 L10W.1 U10W.11(RF_1)
WIFI_RF1L: C11W.1 L10W.2 P10W.SIG(X)
WIFI_RF2: C12W.1 L11W.1 U10W.12(RF_2)
WIFI_RF2L: C13W.1 L11W.2 P11W.SIG(X)
WIFI_SCLK: U10W.26(SDIO_CLK/SPI_CLK)
WIFI_WIRQ: U10W.29(SDIO_DAT1/SPI_WIRQ)
WIFI_WUP: U10W.16(GPIO/WUP)
NetD11W_2: D11W.2(K) D12W.1(A)
NetD12W_2: D12W.2(K) D13W.1(A)
NetD13W_2: D13W.2(K) D14W.1(A)
NetD14W_2: D14W.2(K) D15W.1(A)
NetD15W_2: D15W.2(K) D16W.1(A)
NetR11W_1: R11W.1 U10W.30(SDIO_DAT2/HIF_SEL)
NetR12W_1: R12W.1 U14W.1(SDO/SA0)
NetR15W_2: R15W.2 U12W.5(~{RESET}/GPIO)
NetU10W_7: U10W.7(XTAL_I) Y10W.3(OSC2)
NetU10W_8: U10W.8(XTAL_O) Y10W.1(OSC1)

Not connected (* = marked no-connect by the designer): U10W 1(GPIO/FEM_1)* 2(GPIO/FEM_2)* 3(GPIO/FEM_3)* 5(GPIO/FEM_PDET)* 6(RESERVE_2)* 17(GPIO/FEM_5)* 18(GPIO/FEM_6)* 19(PTA_TX_CONF)* 20(PTA_RF_ACT)* 21(PTA_STATUS)* 22(PTA_FREQ)* 24(GPIO/WIRQ)*; U14W 9(INT2) 10(NC) 11(NC)

### Layout directives
net class SE_50: WIFI_RF1, WIFI_RF1L, WIFI_RF2, WIFI_RF2L

### Notes on the sheet
- (near U10W) Wifi Subsystem
- U DOMAIN
- VDDIO
- VDD_DIG
- (near U10W) LP_CLK: 32.768kHz +/- 100ppm for lowest power
- VDD_RF
- VDD_PA
- Addr 0x6B (7-bit)
- 3.3V nom swing signals
- configure push-pull
- 3.6-5uA shutdown
- SCLK
- SI
- SCS
- (near P12W) EXTCOMMIN
- DISP
- (near U14W) Tie SA0 to 1.8V to set I2C addr to 0x6B
- VDDA
- VDD
- (near P12W) EXTMODE
- VSS
- VSSA
- (near R16W) 23.8mA Imax
- EXTMODE=1, EXTCOMMIN needs 1Hz signal
- LCD_DISP and EXTCOMMIN from UP5K
- (near NT10W) Both are necessary to display while in standby
- License: CERN-OHL-L
- Copyright © 2021 Andrew "bunnie" Huang
- https://www.ohwr.org/project/cernohl/wikis/home
- Precursor to Betrusted - Mainboard

### Library data of the parts
C10W C12W = Cap Semi: Capacitor (Semiconductor SIM Model); MPN: GRM0335C1H1R8BA01D; VENDOR: Murata; MYPN: C-1R8-50-NP0-0201
C11W C13W = Cap Semi: Capacitor (Semiconductor SIM Model); MPN: GRM0335C1ER80BA01D; VENDOR: Murata; MYPN: C-0R8-25-NP0-0201
C14W C22W C31W C32W C33W = Cap Semi: Capacitor (Semiconductor SIM Model); MPN: CL03A104KQ3NNNC; VENDOR: Samsung; MYPN: C-104-6p3-X5R-0201
C15W C18W C21W C23W = Cap Semi: Capacitor (Semiconductor SIM Model); MPN: CL10A106MQ8NNNC; VENDOR: Samsung; MYPN: C-106-6.3-X5R-0603
C16W C19W = Cap Semi: Capacitor (Semiconductor SIM Model); MPN: GRM033C81A473KE05D; VENDOR: Murata; MYPN: C-473-10-X6S-0201
C17W C20W = Cap Semi: Capacitor (Semiconductor SIM Model); MPN: GRM0335C1E120JA01D; VENDOR: Murata; MYPN: C-120-25-NP0-0201
C24W = Cap Semi: Capacitor (Semiconductor SIM Model); MPN: GRM033R61E103KA12D; VENDOR: Murata; MYPN: C-103-25-X5R-0201
C25W C26W C27W = Cap Semi: Capacitor (Semiconductor SIM Model); MPN: CL10A105KA8NNNC; VENDOR: Samsung; MYPN: C-105-25-X5R-0603
C28W = Cap Semi: Capacitor (Semiconductor SIM Model); MPN: GRM0335C1E561JA01D; VENDOR: Murata; MYPN: C-561-25-NP0-0201
C29W C30W = Cap Semi: Capacitor (Semiconductor SIM Model); MPN: GRM033R60J105MEA2D; VENDOR: Murata; MYPN: C-105-6p3-X5R-0201
D10W = Diode 11DQ03: Schottky Rectifier; MYPN: D-SCHOTTKY-0402-CSP; VENDOR: Vishay; ComponentLink1Description: Manufacturer Link; ComponentLink1URL: http://www.irf.com/; ComponentLink2Description: Datasheet; ComponentLink2URL: http://www.irf.com/product-info/datasheets/data/11dq03.pdf; MPN: VSKY05301006-G4-08
D11W D12W D13W D14W D15W D16W = LED2: White LED, 0603, 900mcd, 0.4mm; MYPN: D-LED-WHT-0603-0.4mm; VENDOR: Inolux; Published: 8-Jun-2000; LatestRevisionDate: 17-Jul-2002; LatestRevisionNote: Re-released for DXP Platform.; PackageVersion: Feb-2002; PackageReference: 3.2X1.6X1.1; Publisher: Altium Limited; MPN: IN-S63AT5UW
J10U J10W = CON1: Connector; MYPN: J-TP-PWRTAP-0603; MPN: DNP; VENDOR: DNP
L10W L11W = Inductor Iron: Magnetic-Core Inductor; MPN: LQW15AN2N7C00; VENDOR: Murata; MYPN: L-LQW15AN2N7C00
L12W L13W = Inductor Iron: Magnetic-Core Inductor; MPN: BLM18AG601SN1D; VENDOR: Murata; MYPN: L-BLM18AG601SN1D
L14W = Inductor Iron: Magnetic-Core Inductor; MPN: LQH3NPN100MJRL; VENDOR: Murata; MYPN: L-LQH3NPN100MJRL
NT10W = NOTE: Placeholder for non-board BOM items; MYPN: NT-LCD-LS032B7DD02; MPN: LS032B7DD02; VENDOR: Sharp
P10W P11W = BNC: U.FL Gen2 0.81mm OD, 1.62mm mated height; MPN: P1163-0140R; VENDOR: Kaweei; MYPN: U.FL-R-SMT-1(10); LatestRevisionDate: 17-Jul-2002; LatestRevisionNote: Re-released for DXP Platform.; Publisher: Altium Limited
P12W = Header 10: Header, 10-Pin; VENDOR: Hirose; MYPN: J-FH34SRJ-10S-0.5SH(50/99); LatestRevisionDate: 17-Jul-2002; LatestRevisionNote: Re-released for DXP Platform.; Publisher: Altium Limited; MPN: FH34SRJ-10S-0.5SH
P13W = Header 4: 4-pin FPC connector; MPN: FH34SRJ-4S-0.5SH(XX); VENDOR: HRS; MYPN: J-FH34SRJ-4S-0.5SH(99); LatestRevisionDate: 17-Jul-2002; LatestRevisionNote: Re-released for DXP Platform.; Publisher: Altium Limited
R10W R11W R15W R16W = Res1: Resistor; VENDOR: ANY; MYPN: R-103-1P-1_16W-0201; MPN: ANY
R12W = Res1: Resistor; VENDOR: ANY; MYPN: R-102-1P-1_16W-0201; MPN: ANY
R14W = Res1: Resistor; VENDOR: ANY; MYPN: R-104-1P-1_16W-0201; MPN: ANY
U10W = WF200C(R): Wifi Network Coprocessor; VENDOR: SiLabs; MYPN: U-WF200D(R); MPN: WF200D
U11W = SiT1532: 10ppm ultra low power 32.768 kHz replacement; MPN: SIT1532AI-J4-DCC-32.768E; VENDOR: SiTime; MYPN: U-SIT1532AX-JX-DCC-32.768X
U12W = LM3509SDE/NOPB: MYPN: U-LM3509SDE/NOPB; VENDOR: TI; MPN: LM3509SDE/NOPB
U14W = LSM6DS3TR: iNEMO Inertial Module: Always-on 3D Accelerometer and 3D Gyroscope, 1.71 to 3.6 V, -40 to 85 degC, 14-Pin LGA, RoHS, Tape and Reel; Sensing Distance: 2|4|6|8|16G; Number of Axis: 3; VENDOR: STMicroelectronics; Output Type: Digital; Lead Finish: GoldOverNickel; Max Processing Temp: 260; Screening Level: Industrial; Typical Supply Current: 1.25Milliamps; Operating Supply Voltage: 1.8volt; MYPN: U-LSM6DSLTR; Type: AccelerometerandGyroscope; Datasheet Version: Rev. 8, 02/2016; Datasheet URL: http://www2.st.com/content/ccc/resource/technical/document/datasheet/a3/f5/4f/ae/8e/44/41/d7/DM00133076.pdf/files/DM00133076.pdf/jcr:content/translations/en.DM00133076.pdf; Mounting: SurfaceMount; Manufacturer URL: http://www.st.com/; Operating Temperature: -40to85C; MPN: LSM6DSLTR
Y10W = XTAL: Crystal Oscillator; MPN: ECS-384-10-33B-CKY-TR; VENDOR: ECS; MYPN: X-38.4000-40OHM-10PF-10PPM; Published: 8-Jun-2000; LatestRevisionDate: 17-Jul-2002; LatestRevisionNote: Re-released for DXP Platform.; PackageReference: R38; Publisher: Altium Limited; PackageDescription: Crystal, Thru-Hole; 2 Leads; Body 3.1 x 8.2 mm (Dia.xH)

## Sheet 05_kbd_pm.SchDoc
size B
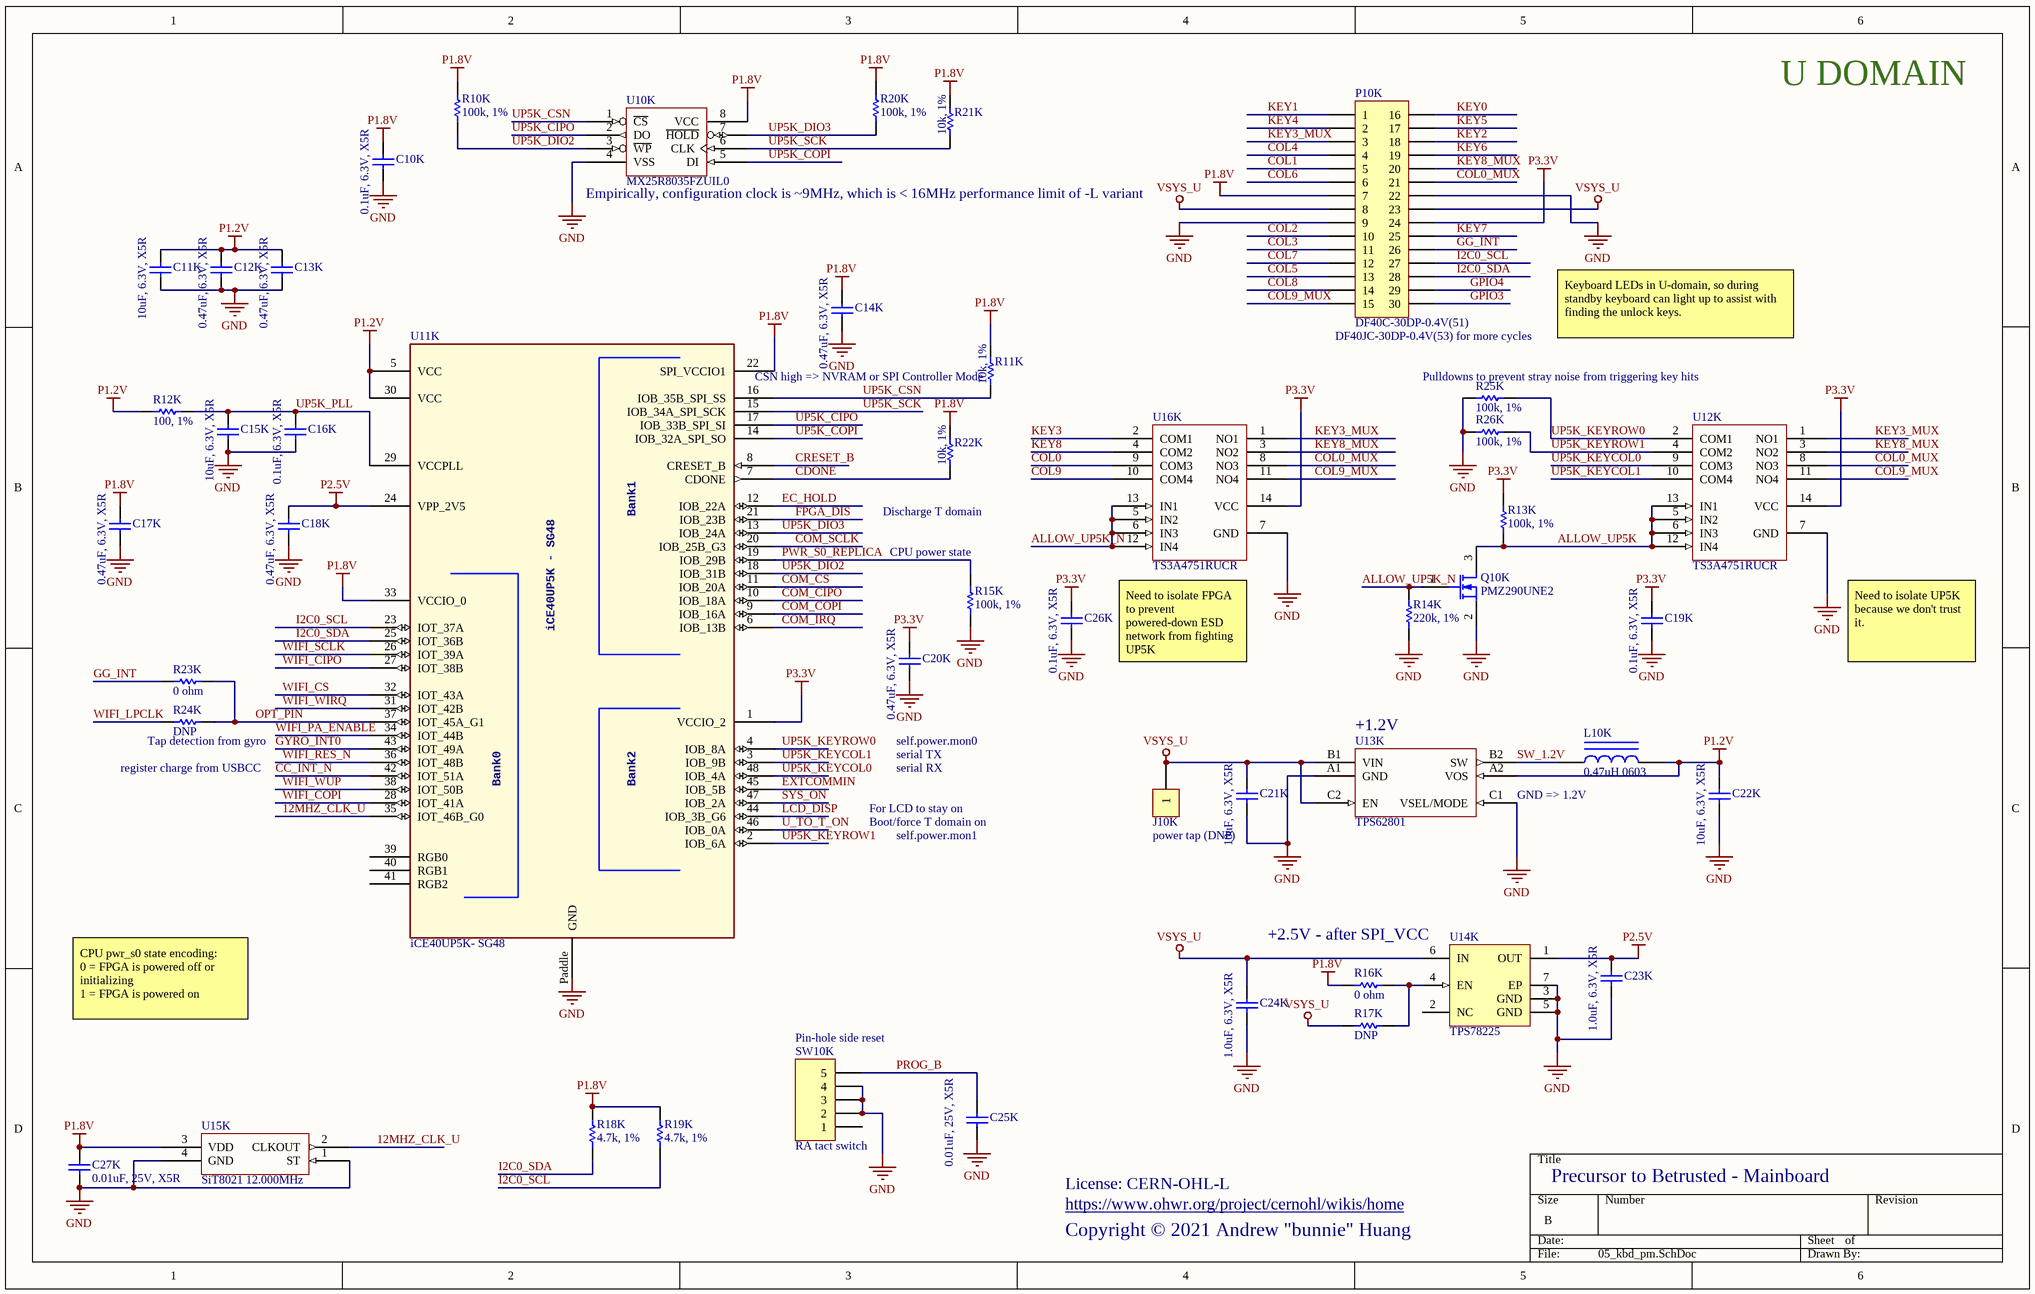
[diagram p6: 05_kbd_pm.SchDoc]

### Parts
C10K  0.1uF, 6.3V, X5R  [B_CAP0201]
C11K  10uF, 6.3V, X5R  [B_CAP0603]
C12K  0.47uF, 6.3V, X5R  [B_CAP0201]
C13K  0.47uF, 6.3V, X5R  [B_CAP0201]
C14K  0.47uF, 6.3V, X5R  [B_CAP0201]
C15K  10uF, 6.3V, X5R  [B_CAP0603]
C16K  0.1uF, 6.3V, X5R  [B_CAP0201]
C17K  0.47uF, 6.3V, X5R  [B_CAP0201]
C18K  0.47uF, 6.3V, X5R  [B_CAP0201]
C19K  0.1uF, 6.3V, X5R  [B_CAP0201]
C20K  0.47uF, 6.3V, X5R  [B_CAP0201]
C21K  10uF, 6.3V, X5R  [B_CAP0603]
C22K  10uF, 6.3V, X5R  [B_CAP0603]
C23K  1.0uF, 6.3V, X5R  [B_CAP0201]
C24K  1.0uF, 6.3V, X5R  [B_CAP0201]
C25K  0.01uF, 25V, X5R  [B_RES0201]
C26K  0.1uF, 6.3V, X5R  [B_CAP0201]
C27K  0.01uF, 25V, X5R  [B_RES0201]
J10K  power tap (DNP)  [B_PWRTAP0402]
L10K  0.47uH 0603  [B_IND0603]
P10K  DF40C-30DP-0.4V(51)  [HRS_DF40C-30DP-0.4V(51)]
Q10K  PMZ290UNE2  [SOT883]
R10K  100k, 1%  [B_RES0201]
R11K  10k, 1%  [B_RES0201]
R12K  100, 1%  [B_RES0402]
R13K  100k, 1%  [B_RES0201]
R14K  220k, 1%  [B_RES0201]
R15K  100k, 1%  [B_RES0201]
R16K  0 ohm  [B_RES0201]
R17K  DNP  [B_RES0201]
R18K  4.7k, 1%  [B_RES0201]
R19K  4.7k, 1%  [B_RES0201]
R20K  100k, 1%  [B_RES0201]
R21K  10k, 1%  [B_RES0201]
R22K  10k, 1%  [B_RES0201]
R23K  0 ohm  [B_RES0201]
R24K  DNP  [B_RES0201]
R25K  100k, 1%  [B_RES0201]
R26K  100k, 1%  [B_RES0201]
SW10K  RA tact switch  [CK_KMS221GPLFS]
U10K  MX25R8035FZUIL0  [USON-8]
U11K  iCE40UP5K- SG48  [UP5K_QFN127P600-8N]
U12K  TS3A4751RUCR  [QFN40P200X200X40-14L]
U13K  TPS62801  [BGA6C35P2X3_70X105X40_NSMD]
U14K  TPS78225  [TI-DRV6-1600X1000TP_V]
U15K  SiT8021 12.000MHz  [SiTIME_CSP]
U16K  TS3A4751RUCR  [QFN40P200X200X40-14L]

### Nets
GND: C10K.2 C11K.2 C12K.2 C13K.2 C14K.2 C15K.2 C16K.2 C17K.2 C18K.2 C19K.2 C20K.2 C21K.2 C22K.2 C23K.2 C24K.2 C25K.2 C26K.2 C27K.2 P10K.9 P10K.22 Q10K.2(S) R14K.1 R15K.1 R25K.2 R26K.2 SW10K.2 SW10K.3 SW10K.4 U10K.4(VSS) U11K.Paddle(GND) U12K.7(GND) U13K.A1(GND) U13K.C1(VSEL/MODE) U14K.3(GND) U14K.5(GND) U14K.7(EP) U15K.1(ST) U15K.4(GND) U16K.7(GND)
P1.2V: C11K.1 C12K.1 C13K.1 C22K.1 L10K.2 R12K.2 U11K.5(VCC) U11K.30(VCC) U13K.A2(VOS)
P1.8V: C10K.1 C14K.1 C17K.1 C27K.1 P10K.7 R10K.2 R11K.1 R16K.1 R18K.2 R19K.2 R20K.2 R21K.1 R22K.1 U10K.8(VCC) U11K.22(SPI_VCCIO1) U11K.33(VCCIO_0) U15K.3(VDD)
P2.5V: C18K.1 C23K.1 U11K.24(VPP_2V5) U14K.1(OUT)
P3.3V: C19K.1 C20K.1 C26K.1 P10K.24 R13K.2 U11K.1(VCCIO_2) U12K.14(VCC) U16K.14(VCC)
VSYS_U: C21K.1 C24K.1 J10K.1 P10K.8 P10K.23 R17K.1 U13K.B1(VIN) U13K.C2(EN) U14K.6(IN)
12MHZ_CLK_U: U11K.35(IOT_46B_G0) U15K.2(CLKOUT)
ALLOW_UP5K: Q10K.3(D) R13K.1 U12K.5(IN2) U12K.6(IN3) U12K.12(IN4) U12K.13(IN1)
ALLOW_UP5K_N: Q10K.1(G) R14K.2 U16K.5(IN2) U16K.6(IN3) U16K.12(IN4) U16K.13(IN1)
CC_INT_N: U11K.42(IOT_51A)
CDONE: R22K.2 U11K.7(CDONE)
COL0: U16K.9(COM3)
COL0_MUX: P10K.21 U12K.8(NO3) U16K.8(NO3)
COL1: P10K.5
COL2: P10K.10
COL3: P10K.11
COL4: P10K.4
COL5: P10K.13
COL6: P10K.6
COL7: P10K.12
COL8: P10K.14
COL9: U16K.10(COM4)
COL9_MUX: P10K.15 U12K.11(NO4) U16K.11(NO4)
COM_CIPO: U11K.10(IOB_18A)
COM_COPI: U11K.9(IOB_16A)
COM_CS: U11K.11(IOB_20A)
COM_IRQ: U11K.6(IOB_13B)
COM_SCLK: U11K.20(IOB_25B_G3)
CRESET_B: U11K.8(CRESET_B)
EC_HOLD: U11K.12(IOB_22A)
EXTCOMMIN: U11K.45(IOB_5B)
FPGA_DIS: U11K.21(IOB_23B)
GG_INT: P10K.26 R23K.1
GPIO3: P10K.30
GPIO4: P10K.29
GYRO_INT0: U11K.43(IOT_49A)
I2C0_SCL: P10K.27 R19K.1 U11K.23(IOT_37A)
I2C0_SDA: P10K.28 R18K.1 U11K.25(IOT_36B)
KEY0: P10K.16
KEY1: P10K.1
KEY2: P10K.18
KEY3: U16K.2(COM1)
KEY3_MUX: P10K.3 U12K.1(NO1) U16K.1(NO1)
KEY4: P10K.2
KEY5: P10K.17
KEY6: P10K.19
KEY7: P10K.25
KEY8: U16K.4(COM2)
KEY8_MUX: P10K.20 U12K.3(NO2) U16K.3(NO2)
LCD_DISP: U11K.44(IOB_3B_G6)
OPT_PIN: R23K.2 R24K.2 U11K.37(IOT_45A_G1)
PROG_B: C25K.1 SW10K.5
PWR_S0_REPLICA: R15K.2 U11K.19(IOB_29B)
SW_1.2V: L10K.1 U13K.B2(SW)
SYS_ON: U11K.47(IOB_2A)
U_TO_T_ON: U11K.46(IOB_0A)
UP5K_CIPO: U10K.2(DO) U11K.17(IOB_33B_SPI_SI)
UP5K_COPI: U10K.5(DI) U11K.14(IOB_32A_SPI_SO)
UP5K_CSN: R11K.2 U10K.1(~{CS}) U11K.16(IOB_35B_SPI_SS)
UP5K_DIO2: R10K.1 U10K.3(~{WP}) U11K.18(IOB_31B)
UP5K_DIO3: R20K.1 U10K.7(~{HOLD}) U11K.13(IOB_24A)
UP5K_KEYCOL0: U11K.48(IOB_4A) U12K.9(COM3)
UP5K_KEYCOL1: U11K.3(IOB_9B) U12K.10(COM4)
UP5K_KEYROW0: R25K.1 U11K.4(IOB_8A) U12K.2(COM1)
UP5K_KEYROW1: R26K.1 U11K.2(IOB_6A) U12K.4(COM2)
UP5K_PLL: C15K.1 C16K.1 R12K.1 U11K.29(VCCPLL)
UP5K_SCK: R21K.2 U10K.6(CLK) U11K.15(IOB_34A_SPI_SCK)
WIFI_CIPO: U11K.27(IOT_38B)
WIFI_COPI: U11K.28(IOT_41A)
WIFI_CS: U11K.32(IOT_43A)
WIFI_LPCLK: R24K.1
WIFI_PA_ENABLE: U11K.34(IOT_44B)
WIFI_RES_N: U11K.36(IOT_48B)
WIFI_SCLK: U11K.26(IOT_39A)
WIFI_WIRQ: U11K.31(IOT_42B)
WIFI_WUP: U11K.38(IOT_50B)
NetR16K_2: R16K.2 R17K.2 U14K.4(EN)

Not connected (* = marked no-connect by the designer): SW10K 1; U11K 39(RGB0) 40(RGB1) 41(RGB2); U14K 2(NC)

### Notes on the sheet
- U DOMAIN
- (near U10K) Empirically, configuration clock is ~9MHz, which is < 16MHz performance limit of -L variant
- (near P10K) DF40JC-30DP-0.4V(53) for more cycles
- Keyboard LEDs in U-domain, so during standby keyboard can light up to assist with finding the unlock keys.
- (near R11K) CSN high => NVRAM or SPI Controller Mode
- (near R25K) Pulldowns to prevent stray noise from triggering key hits
- (near R22K) Discharge T domain
- (near R15K) CPU power state
- Need to isolate FPGA to prevent powered-down ESD network from fighting UP5K
- Need to isolate UP5K because we don't trust it.
- (near R24K) register charge from USBCC
- (near R24K) Tap detection from gyro
- self.power.mon0
- serial TX
- serial RX
- (near U13K) +1.2V
- Boot/force T domain on
- For LCD to stay on
- self.power.mon1
- GND => 1.2V
- (near U14K) +2.5V - after SPI_VCC
- CPU pwr_s0 state encoding:
  0 = FPGA is powered off or initializing
  1 = FPGA is powered on
- (near SW10K) Pin-hole side reset
- Precursor to Betrusted - Mainboard
- License: CERN-OHL-L
- Copyright © 2021 Andrew "bunnie" Huang
- https://www.ohwr.org/project/cernohl/wikis/home
- (in symbol iCE40UP5K- SG48) Bank1; iCE40UP5K - SG48; Bank0; Bank2

### Library data of the parts
C10K C16K C19K C26K = Cap Semi: as C14W on sheet 04_io
C11K C15K C21K C22K = Cap Semi: as C15W on sheet 04_io
C12K C13K C14K C17K C18K C20K = Cap Semi: Capacitor (Semiconductor SIM Model); MPN: CL03A474KQ3NNNH; VENDOR: Samsung; MYPN: C-474-6p3-X5R-0201
C23K C24K = Cap Semi: as C29W on sheet 04_io
C25K C27K = Cap Semi: as C24W on sheet 04_io
J10K = CON1: Connector; MYPN: J-TP-PWRTAP-0603; MPN: DNP; VENDOR: DNP
L10K = Inductor Iron: Magnetic-Core Inductor; MPN: TFM160808ALC-R47MTAA; VENDOR: TDK; MYPN: L-TFM160808ALC-R47MTAA
P10K = Header 15X2A: Header, 15-Pin, Dual row; MYPN: J-DF40C-30DP-0.4V(51) or DF40JC-30DP-0.4V(53); VENDOR: Hirose; System: Connector; LatestRevisionDate: 17-Jul-2002; LatestRevisionNote: Re-released for DXP Platform.; Publisher: Altium Limited; MPN: DF40C-30DP-0.4V(51)
Q10K = MOSFET-N: N-Channel MOSFET; VENDOR: Nexperia; MYPN: Q-PMZ290UNE2; Published: 8-Jun-2000; LatestRevisionDate: 17-Jul-2002; LatestRevisionNote: Re-released for DXP Platform.; PackageVersion: 1995/1996; PackageReference: E3; Publisher: Altium Limited; MPN: PMZ290UNE2
R10K R13K R15K R20K R25K R26K = Res1: as R14W on sheet 04_io; MPN: ANY
R11K R21K R22K = Res1: as R10W on sheet 04_io; MPN: ANY
R12K = Res1: Resistor; VENDOR: ANY; MYPN: R-101-1P-1_16W-0402; MPN: ANY
R14K = Res1: Resistor; VENDOR: ANY; MYPN: R-224-1P-1_16W-0201; MPN: ANY
R16K R23K = Res1: Resistor; VENDOR: ANY; MYPN: R-0R0-1P-1_16W-0201; MPN: ANY
R17K R24K = Res1: Resistor; VENDOR: ANY; MYPN: DNP; MPN: ANY
R18K R19K = Res1: Resistor; VENDOR: ANY; MYPN: R-472-1P-1_16W-0201; MPN: ANY
SW10K = Header 5: MPN: KMS221GPLFS; VENDOR: C&K; MYPN: SW-KMS221GPLFS; LatestRevisionDate: 17-Jul-2002; LatestRevisionNote: Re-released for DXP Platform.; Publisher: Altium Limited
U10K = EN25P05-50GCP: 64Mbit SPI NOR FLASH; MYPN: UMX25R8035FZUIL0; VENDOR: Macronix; MPN: MX25R8035FZUIL0
U11K = iCE40UP5K- SG48: MPN: ICE40UP5K-SG48I; MYPN: U-ICE40UP5K-SG48I; VENDOR: Lattice
U12K U16K = TS3A4751RGYR: 0.9 ohm low voltage, single supply, 4-channel SPST analog switch; MYPN: U-TS3A4751RUCR; VENDOR: TI; MPN: TS3A4751RUCR
U13K = TPS62801: Buck regulator, 4MHz, 0.6A, 0.8V-1.55V, low Iq; MPN: TPS62801YKAT; VENDOR: TI; MYPN: U-TPS62801YKA(T/R)
U14K = TI-TPS78225-Q1DRV6-1600X1000TP: 500nA Iq, 150mA LDO; MPN: TPS78225DRVT; VENDOR: TI; MYPN: U-TPS78225DRV(T/R)
U15K = SiT8021: 1 to 26 MHz micropower oscillator; MPN: SIT8021AI-J4-18S-12.000000E; VENDOR: SiTime; MYPN: U-SIT8021AI-J4-18S-12.000000E

## Sheet 06_rng.SchDoc
size A
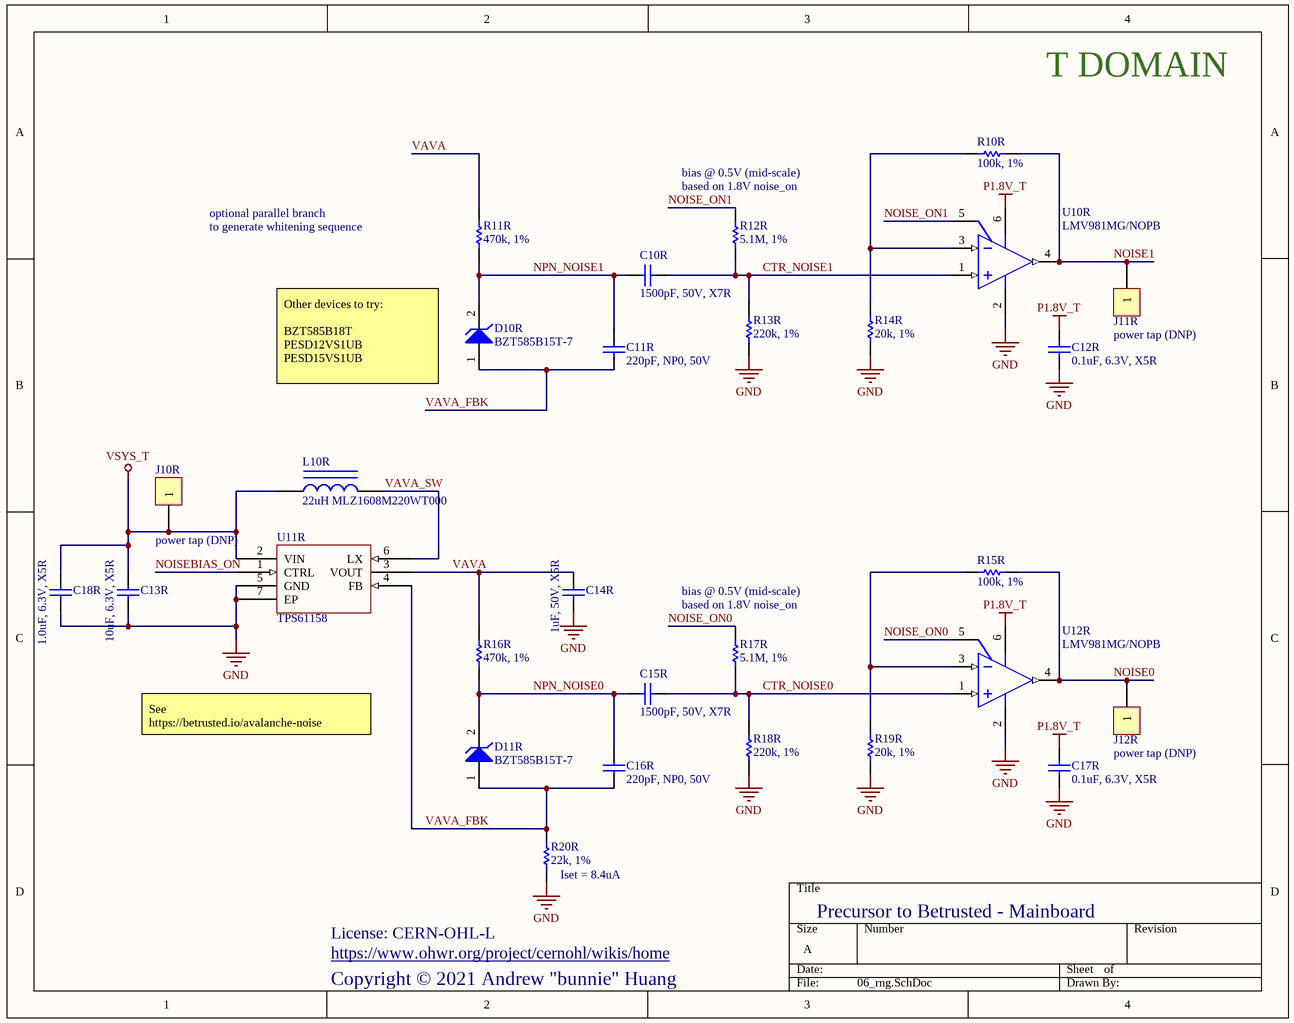
[diagram p7: 06_rng.SchDoc]

### Parts
C10R  1500pF, 50V, X7R  [B_CAP0402]
C11R  220pF, NP0, 50V  [B_CAP0402]
C12R  0.1uF, 6.3V, X5R  [B_CAP0201]
C13R  10uF, 6.3V, X5R  [B_CAP0603]
C14R  1uF, 50V, X5R  [B_CAP0603]
C15R  1500pF, 50V, X7R  [B_CAP0402]
C16R  220pF, NP0, 50V  [B_CAP0402]
C17R  0.1uF, 6.3V, X5R  [B_CAP0201]
C18R  1.0uF, 6.3V, X5R  [B_CAP0201]
D10R  BZT585B15T-7  [SOD523]
D11R  BZT585B15T-7  [SOD523]
J10R  power tap (DNP)  [B_PWRTAP0402]
J11R  power tap (DNP)  [B_PWRTAP0402]
J12R  power tap (DNP)  [B_PWRTAP0402]
L10R  22uH MLZ1608M220WT000  [INDC1608AN]
R10R  100k, 1%  [B_RES0201]
R11R  470k, 1%  [B_RES0402]
R12R  5.1M, 1%  [B_RES0402]
R13R  220k, 1%  [B_RES0201]
R14R  20k, 1%  [B_RES0201]
R15R  100k, 1%  [B_RES0201]
R16R  470k, 1%  [B_RES0402]
R17R  5.1M, 1%  [B_RES0402]
R18R  220k, 1%  [B_RES0201]
R19R  20k, 1%  [B_RES0201]
R20R  22k, 1%  [B_RES0402]
U10R  LMV981MG/NOPB  [DCK0006A_N]
U11R  TPS61158  [SON65P200X80_HS-7N]
U12R  LMV981MG/NOPB  [DCK0006A_N]

### Nets
GND: C12R.1 C13R.2 C14R.2 C17R.1 C18R.1 R13R.1 R14R.1 R18R.1 R19R.1 R20R.1 U10R.2(GND) U11R.5(GND) U11R.7(EP) U12R.2(GND)
P1.8V_T: C12R.2 C17R.2 U10R.6(VDD) U12R.6(VDD)
VSYS_T: C13R.1 C18R.2 J10R.1 L10R.1 U11R.2(VIN)
CTR_NOISE0: C15R.2 R17R.1 R18R.2 U12R.1(IN+)
CTR_NOISE1: C10R.2 R12R.1 R13R.2 U10R.1(IN+)
NOISE0: J12R.1 R15R.1 U12R.4(OUT)
NOISE1: J11R.1 R10R.1 U10R.4(OUT)
NOISE_ON0: R17R.2 U12R.5(~{SHDN})
NOISE_ON1: R12R.2 U10R.5(~{SHDN})
NOISEBIAS_ON: U11R.1(CTRL)
NPN_NOISE0: C15R.1 C16R.2 D11R.2(K) R16R.1
NPN_NOISE1: C10R.1 C11R.2 D10R.2(K) R11R.1
VAVA: C14R.1 R11R.2 R16R.2 U11R.3(VOUT)
VAVA_FBK: C11R.1 C16R.1 D10R.1(A) D11R.1(A) R20R.2 U11R.4(FB)
VAVA_SW: L10R.2 U11R.6(LX)
NetR10R_2: R10R.2 R14R.2 U10R.3(IN-)
NetR15R_2: R15R.2 R19R.2 U12R.3(IN-)

### Notes on the sheet
- T DOMAIN
- optional parallel branch
- to generate whitening sequence
- (near R12R) bias @ 0.5V (mid-scale)
- (near R12R) based on 1.8V noise_on
- Other devices to try:
  BZT585B18T
  PESD12VS1UB
  PESD15VS1UB
- (near R17R) bias @ 0.5V (mid-scale)
- (near R17R) based on 1.8V noise_on
- See
  https://betrusted.io/avalanche-noise
- (near R20R) Iset = 8.4uA
- License: CERN-OHL-L
- https://www.ohwr.org/project/cernohl/wikis/home
- Precursor to Betrusted - Mainboard
- Copyright © 2021 Andrew "bunnie" Huang

### Library data of the parts
C10R C15R = Cap Semi: Capacitor (Semiconductor SIM Model); MPN: CL05B152KB5NNNC; VENDOR: Samsung; MYPN: C-152-50-X7R-0402
C11R C16R = Cap Semi: Capacitor (Semiconductor SIM Model); MPN: CL05C221JB5NNNC; VENDOR: Samsung; MYPN: C-221-50-NP0-0402
C12R C17R = Cap Semi: as C14W on sheet 04_io
C13R = Cap Semi: as C15W on sheet 04_io
C14R = Cap Semi: Capacitor (Semiconductor SIM Model); MPN: CL10A105KB8NNNC; VENDOR: Samsung; MYPN: C-105-50-X5R-0603
C18R = Cap Semi: as C29W on sheet 04_io
D10R D11R = D Zener: Zener Diode; MYPN: D-Z-15V-SOD523; VENDOR: Diodes Inc; Published: 8-Jun-2000; LatestRevisionDate: 17-Jul-2002; LatestRevisionNote: Re-released for DXP Platform.; PackageReference: DIODE-0.7; Publisher: Altium Limited; PackageDescription: Diode, Thru-Hole; 2 Leads; 0.7 in Pin Spacing; MPN: BZT585B15T-7
J10R J11R J12R = CON1: Connector; MYPN: J-TP-PWRTAP-0603; MPN: DNP; VENDOR: DNP
L10R = Inductor Iron: Magnetic-Core Inductor; VENDOR: TDK; MYPN: L-MLZ1608M220WT000; MPN: MLZ1608M220WT000
R10R R15R = Res1: as R14W on sheet 04_io; MPN: ANY
R11R R16R = Res1: Resistor; VENDOR: ANY; MYPN: R-474-1P-1_16W-0402; MPN: ANY
R12R R17R = Res1: Resistor; MPN: RMCF0402FT5M10; VENDOR: Stackpole; MYPN: R-515-1P-1_16W-0402
R13R R18R = Res1: as R14K on sheet 05_kbd_pm; MPN: ANY
R14R R19R = Res1: Resistor; VENDOR: ANY; MYPN: R-203-1P-1_16W-0201; MPN: ANY
R20R = Res1: Resistor; VENDOR: ANY; MYPN: R-223-1P-1_16W-0402; MPN: ANY
U10R U12R = CMP-0055-01099-3: Single 1.8V, RRIO Operational Amplifiers with Shutdown, 6-pin SC-70, Pb-Free; PowerWise: N; PackageTopMarking: A77*XTT; VENDOR: Texas Instruments; ComponentLink1URL: http://www.ti.com/general/docs/lit/getliterature.tsp?genericPartNumber=LMV981-N&fileType=pdf; PackageDescription: Molded SC-70, 2 x 1.25 x .9mm, 6 Lead, 0.65mm Pitch; RoHS: Y; PinCount: 6; ComponentLink1Description: Datasheet URL; CompType: Amplifiers; Package Reference: DCK0006A; MPN: LMV981MG/NOPB
U11R = TPS61158: 30V WLED driver with integrated power diode; MPN: TPS61158DRVR; VENDOR: TI; MYPN: U-TPS61158DRVR

## Sheet 07_ux.SchDoc
size B
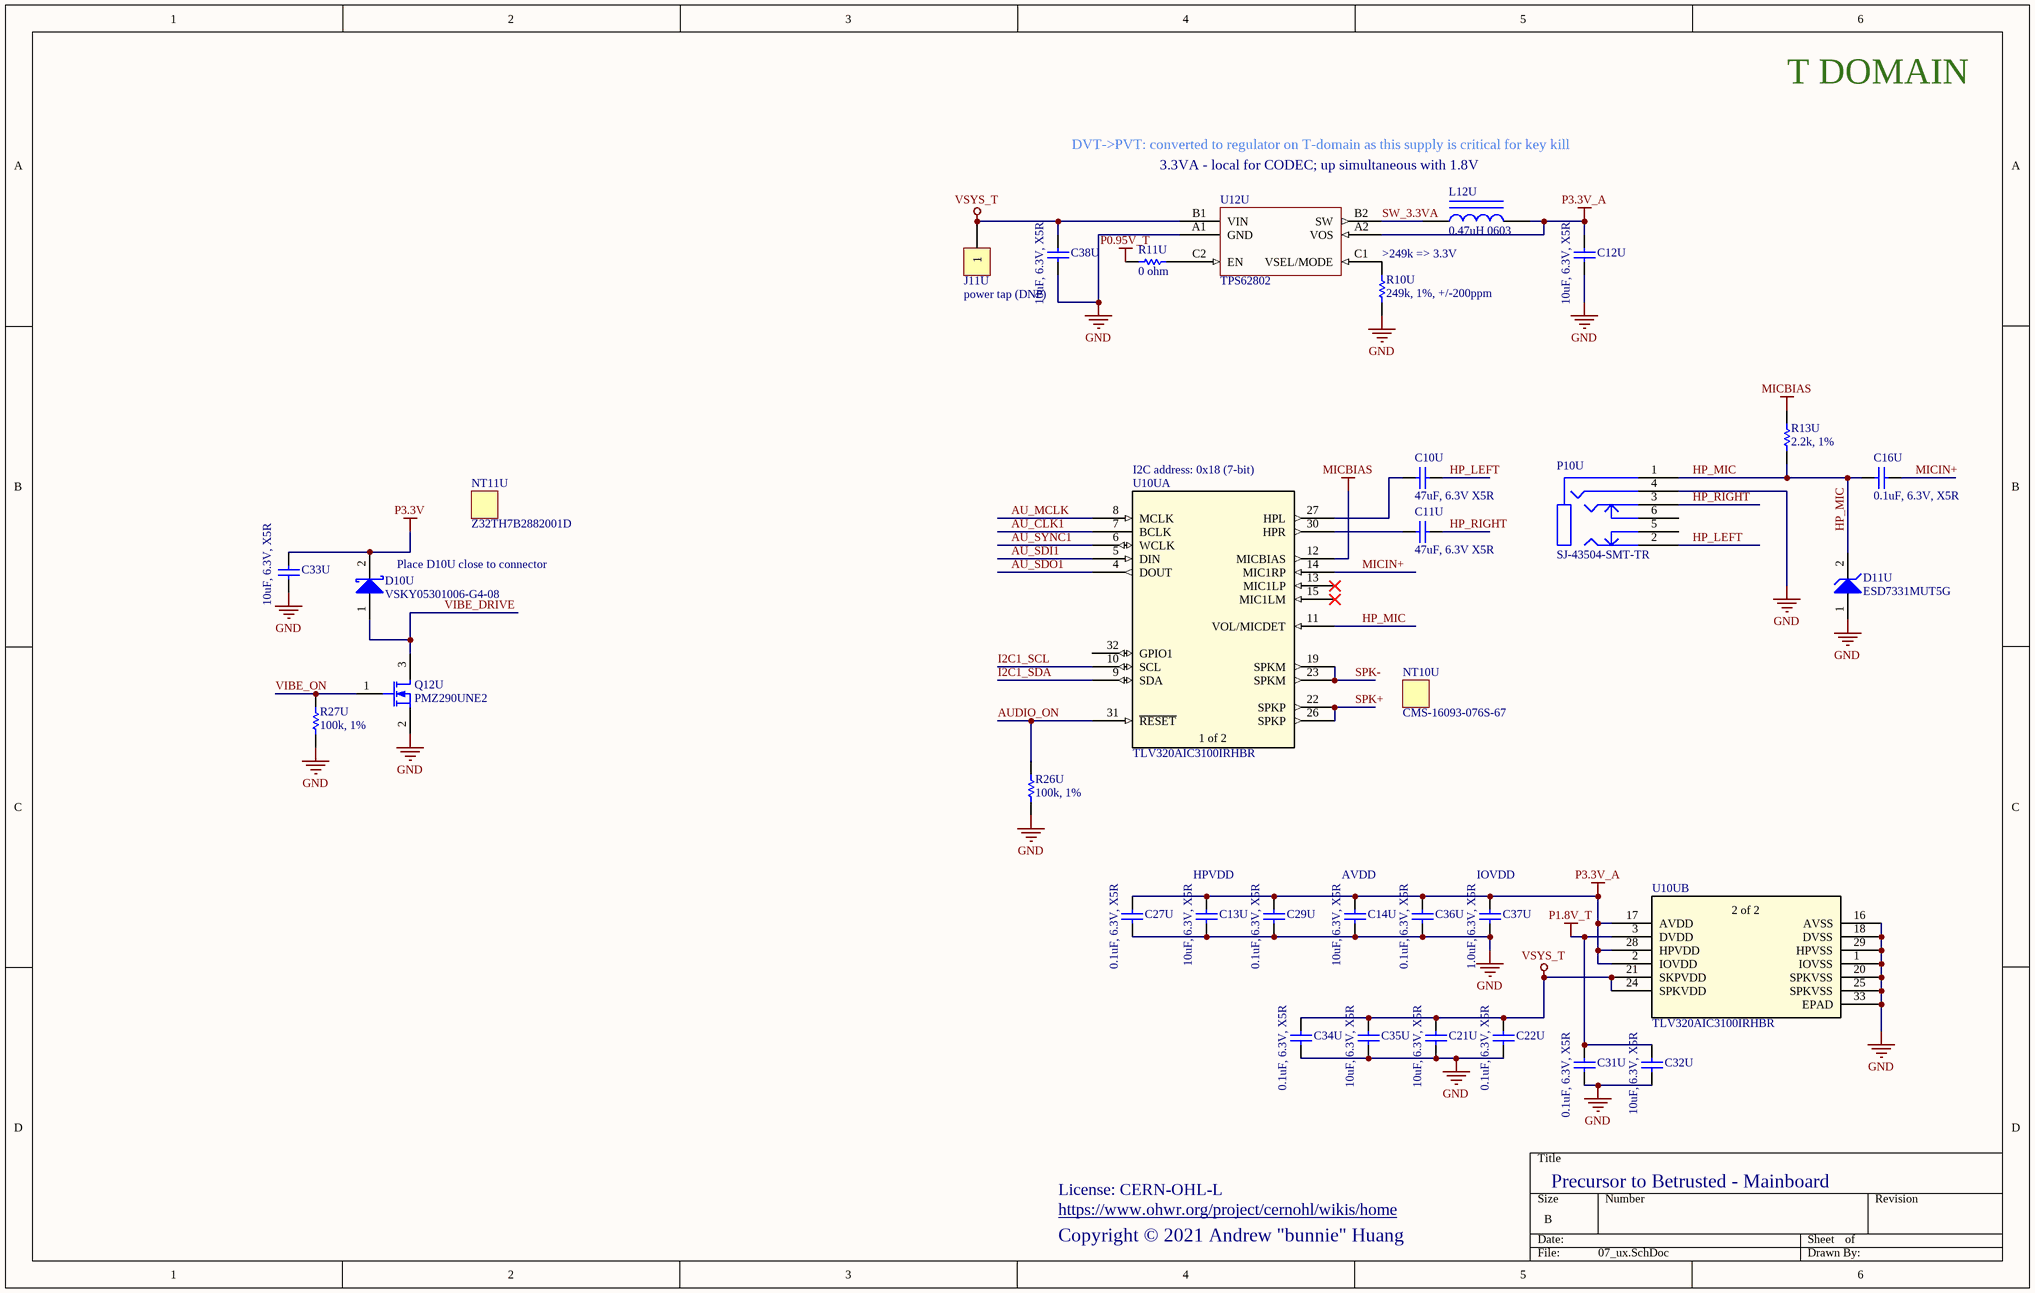
[diagram p8: 07_ux.SchDoc]

### Parts
C10U  47uF, 6.3V X5R  [B_CAP0805]
C11U  47uF, 6.3V X5R  [B_CAP0805]
C12U  10uF, 6.3V, X5R  [B_CAP0603]
C13U  10uF, 6.3V, X5R  [B_CAP0603]
C14U  10uF, 6.3V, X5R  [B_CAP0603]
C16U  0.1uF, 6.3V, X5R  [B_CAP0201]
C21U  10uF, 6.3V, X5R  [B_CAP0603]
C22U  0.1uF, 6.3V, X5R  [B_CAP0201]
C27U  0.1uF, 6.3V, X5R  [B_CAP0201]
C29U  0.1uF, 6.3V, X5R  [B_CAP0201]
C31U  0.1uF, 6.3V, X5R  [B_CAP0201]
C32U  10uF, 6.3V, X5R  [B_CAP0603]
C33U  10uF, 6.3V, X5R  [B_CAP0603]
C34U  0.1uF, 6.3V, X5R  [B_CAP0201]
C35U  10uF, 6.3V, X5R  [B_CAP0603]
C36U  0.1uF, 6.3V, X5R  [B_CAP0201]
C37U  1.0uF, 6.3V, X5R  [B_CAP0201]
C38U  10uF, 6.3V, X5R  [B_CAP0603]
D10U  VSKY05301006-G4-08  [B_DIO0402]
D11U  ESD7331MUT5G  [D_X3DFN2_0201]
J11U  power tap (DNP)  [B_PWRTAP0402]
L12U  0.47uH 0603  [B_IND0603]
NT10U  CMS-16093-076S-67
NT11U  Z32TH7B2882001D
P10U  SJ-43504-SMT-TR  [CUI_SJ_43504_SMT_TR_FLIP]
Q12U  PMZ290UNE2  [SOT883]
R10U  249k, 1%, +/-200ppm  [B_RES0402]
R11U  0 ohm  [B_RES0201]
R13U  2.2k, 1%  [B_RES0201]
R26U  100k, 1%  [B_RES0201]
R27U  100k, 1%  [B_RES0201]
U10U  TLV320AIC3100IRHBR  [TI_VQFN_RHB0032E]  (parts A,B of 2)
U12U  TPS62802  [BGA6C35P2X3_70X105X40_NSMD]

### Nets
GND: C12U.2 C13U.2 C14U.2 C21U.2 C22U.2 C27U.2 C29U.2 C31U.2 C32U.2 C33U.1 C34U.2 C35U.2 C36U.2 C37U.1 C38U.2 D11U.1(A) P10U.4(RING2) Q12U.2(S) R10U.2 R26U.1 R27U.1 U10U.1(IOVSS) U10U.16(AVSS) U10U.18(DVSS) U10U.20(SPKVSS) U10U.25(SPKVSS) U10U.29(HPVSS) U10U.33(EPAD) U12U.A1(GND)
MICBIAS: R13U.2 U10U.12(MICBIAS)
P0.95V_T: R11U.1
P1.8V_T: C31U.1 C32U.1 U10U.3(DVDD)
P3.3V: C33U.2 D10U.2(K)
P3.3V_A: C12U.1 C13U.1 C14U.1 C27U.1 C29U.1 C36U.1 C37U.2 L12U.2 U10U.2(IOVDD) U10U.17(AVDD) U10U.28(HPVDD) U12U.A2(VOS)
VSYS_T: C21U.1 C22U.1 C34U.1 C35U.1 C38U.1 J11U.1 U10U.21(SKPVDD) U10U.24(SPKVDD) U12U.B1(VIN)
AU_CLK1: U10U.7(BCLK)
AU_MCLK: U10U.8(MCLK)
AU_SDI1: U10U.5(DIN)
AU_SDO1: U10U.4(DOUT)
AU_SYNC1: U10U.6(WCLK)
AUDIO_ON: R26U.2 U10U.31(~{RESET})
HP_LEFT: C10U.2 P10U.2(TIP)
HP_MIC: C16U.1 D11U.2(K) P10U.1(SLEEVE) R13U.1 U10U.11(VOL/MICDET)
HP_RIGHT: C11U.2 P10U.3(RING1)
I2C1_SCL: U10U.10(SCL)
I2C1_SDA: U10U.9(SDA)
MICIN+: C16U.2 U10U.14(MIC1RP)
SPK+: U10U.22(SPKP) U10U.26(SPKP)
SPK-: U10U.19(SPKM) U10U.23(SPKM)
SW_3.3VA: L12U.1 U12U.B2(SW)
VIBE_DRIVE: D10U.1(A) Q12U.3(D)
VIBE_ON: Q12U.1(G) R27U.2
NetC10U_1: C10U.1 U10U.27(HPL)
NetC11U_1: C11U.1 U10U.30(HPR)
NetR10U_1: R10U.1 U12U.C1(VSEL/MODE)
NetR11U_2: R11U.2 U12U.C2(EN)

Not connected (* = marked no-connect by the designer): P10U 5(TIP_SW) 6(RING1_SW); U10U 13(MIC1LP)* 15(MIC1LM)* 32(GPIO1)

### Notes on the sheet
- T DOMAIN
- DVT->PVT: converted to regulator on T-domain as this supply is critical for key kill
- 3.3VA - local for CODEC; up simultaneous with 1.8V
- (near R10U) >249k => 3.3V
- (near U10U) I2C address: 0x18 (7-bit)
- Place D10U close to connector
- (near C13U) HPVDD
- (near C14U) AVDD
- (near C37U) IOVDD
- License: CERN-OHL-L
- Copyright © 2021 Andrew "bunnie" Huang
- https://www.ohwr.org/project/cernohl/wikis/home
- Precursor to Betrusted - Mainboard
- (in symbol TLV320AIC3100IRH, part A) 1 of 2
- (in symbol TLV320AIC3100IRH, part B) 2 of 2

### Library data of the parts
C10U C11U = Cap Semi: Capacitor (Semiconductor SIM Model); MPN: CL21A476MQYNNNE; VENDOR: Samsung; MYPN: C-476-6.3-X5R-0805
C12U C13U C14U C21U C32U C33U C35U C38U = Cap Semi: as C15W on sheet 04_io
C16U C22U C27U C29U C31U C34U C36U = Cap Semi: as C14W on sheet 04_io
C37U = Cap Semi: as C29W on sheet 04_io
D10U = Diode 11DQ03: as D10W on sheet 04_io; ComponentLink1Description: Manufacturer Link; ComponentLink1URL: http://www.irf.com/; ComponentLink2Description: Datasheet; ComponentLink2URL: http://www.irf.com/product-info/datasheets/data/11dq03.pdf; MPN: VSKY05301006-G4-08
D11U = D Zener: VENDOR: ON Semi; MYPN: D-ESD7331MUT5G; Published: 8-Jun-2000; LatestRevisionDate: 17-Jul-2002; LatestRevisionNote: Re-released for DXP Platform.; PackageReference: DIODE-0.7; Publisher: Altium Limited; PackageDescription: Diode, Thru-Hole; 2 Leads; 0.7 in Pin Spacing; MPN: ESD7331MUT5G
J11U = CON1: Connector; MYPN: J-TP-PWRTAP-0603; MPN: DNP; VENDOR: DNP
L12U = Inductor Iron: as L10K on sheet 05_kbd_pm
NT10U = NOTE: Placeholder for non-board BOM items; MYPN: NT-CUI-SPEAKER; VENDOR: CUI or Soberton; MPN: CMS-16093-076S-67
NT11U = NOTE: Placeholder for non-board BOM items; MYPN: NT-JL-VIBEMOTOR-3.8MM-3.8MM; VENDOR: Jinlong; MPN: Z32TH7B2882001D
P10U = CUI_3.5MM_STEREO_MIC: Mid mount audio jack; VENDOR: CUI; MYPN: J-3.5MM-MID-CUI; MPN: SJ-43504-SMT-TR
Q12U = MOSFET-N: as Q10K on sheet 05_kbd_pm; Published: 8-Jun-2000; LatestRevisionDate: 17-Jul-2002; LatestRevisionNote: Re-released for DXP Platform.; PackageVersion: 1995/1996; PackageReference: E3; Publisher: Altium Limited; MPN: PMZ290UNE2
R10U = Res1: Resistor; MPN: RC0402FR-07249KL; VENDOR: Yageo; MYPN: R-2493-1P-1_16W-0402
R11U = Res1: as R16K on sheet 05_kbd_pm; MPN: ANY
R13U = Res1: Resistor; VENDOR: ANY; MYPN: R-222-1P-1_16W-0201; MPN: ANY
R26U R27U = Res1: as R14W on sheet 04_io; MPN: ANY
U10U = TLV320AIC3100IRH: Low-Power Audio Codec With Audio Processing and Mono Class-D Amplifier; Manufacturer: Texas Instruments; MPN: TLV320AIC3100IRHBT; INDUSTRY_STD_PKG_TYPE: QFN; PIN_COUNT: 32; PACKAGE_DESIGNATOR: RHB; MYPN: U-TLV320AIC3100IRHBT; Datasheet_URL: http://www.ti.com/lit/gpn/TLV320AIC3100; FAMILY_NAME: Audio CODEC; GENERIC_PART_NUMBER: TLV320AIC3100; VENDOR: Texas Instruments; Manufacturer_Part_Number: TLV320AIC3100IRHBR; Copyright: Copyright (C) 2018 Accelerated Designs. All rights reserved; RefDes: RefDes; Type: DEV
U12U = TPS62802: Buck regulator, 4MHz, 0.6A, 1.8V-3.3V, low Iq; MPN: TPS62802YKAR; VENDOR: TI; MYPN: U-TPS62802YKA(T/R)